# Altium project S7CAS-PLEIADES-CARTES-MERE_P07.PrjPcb (part 1 of 4)
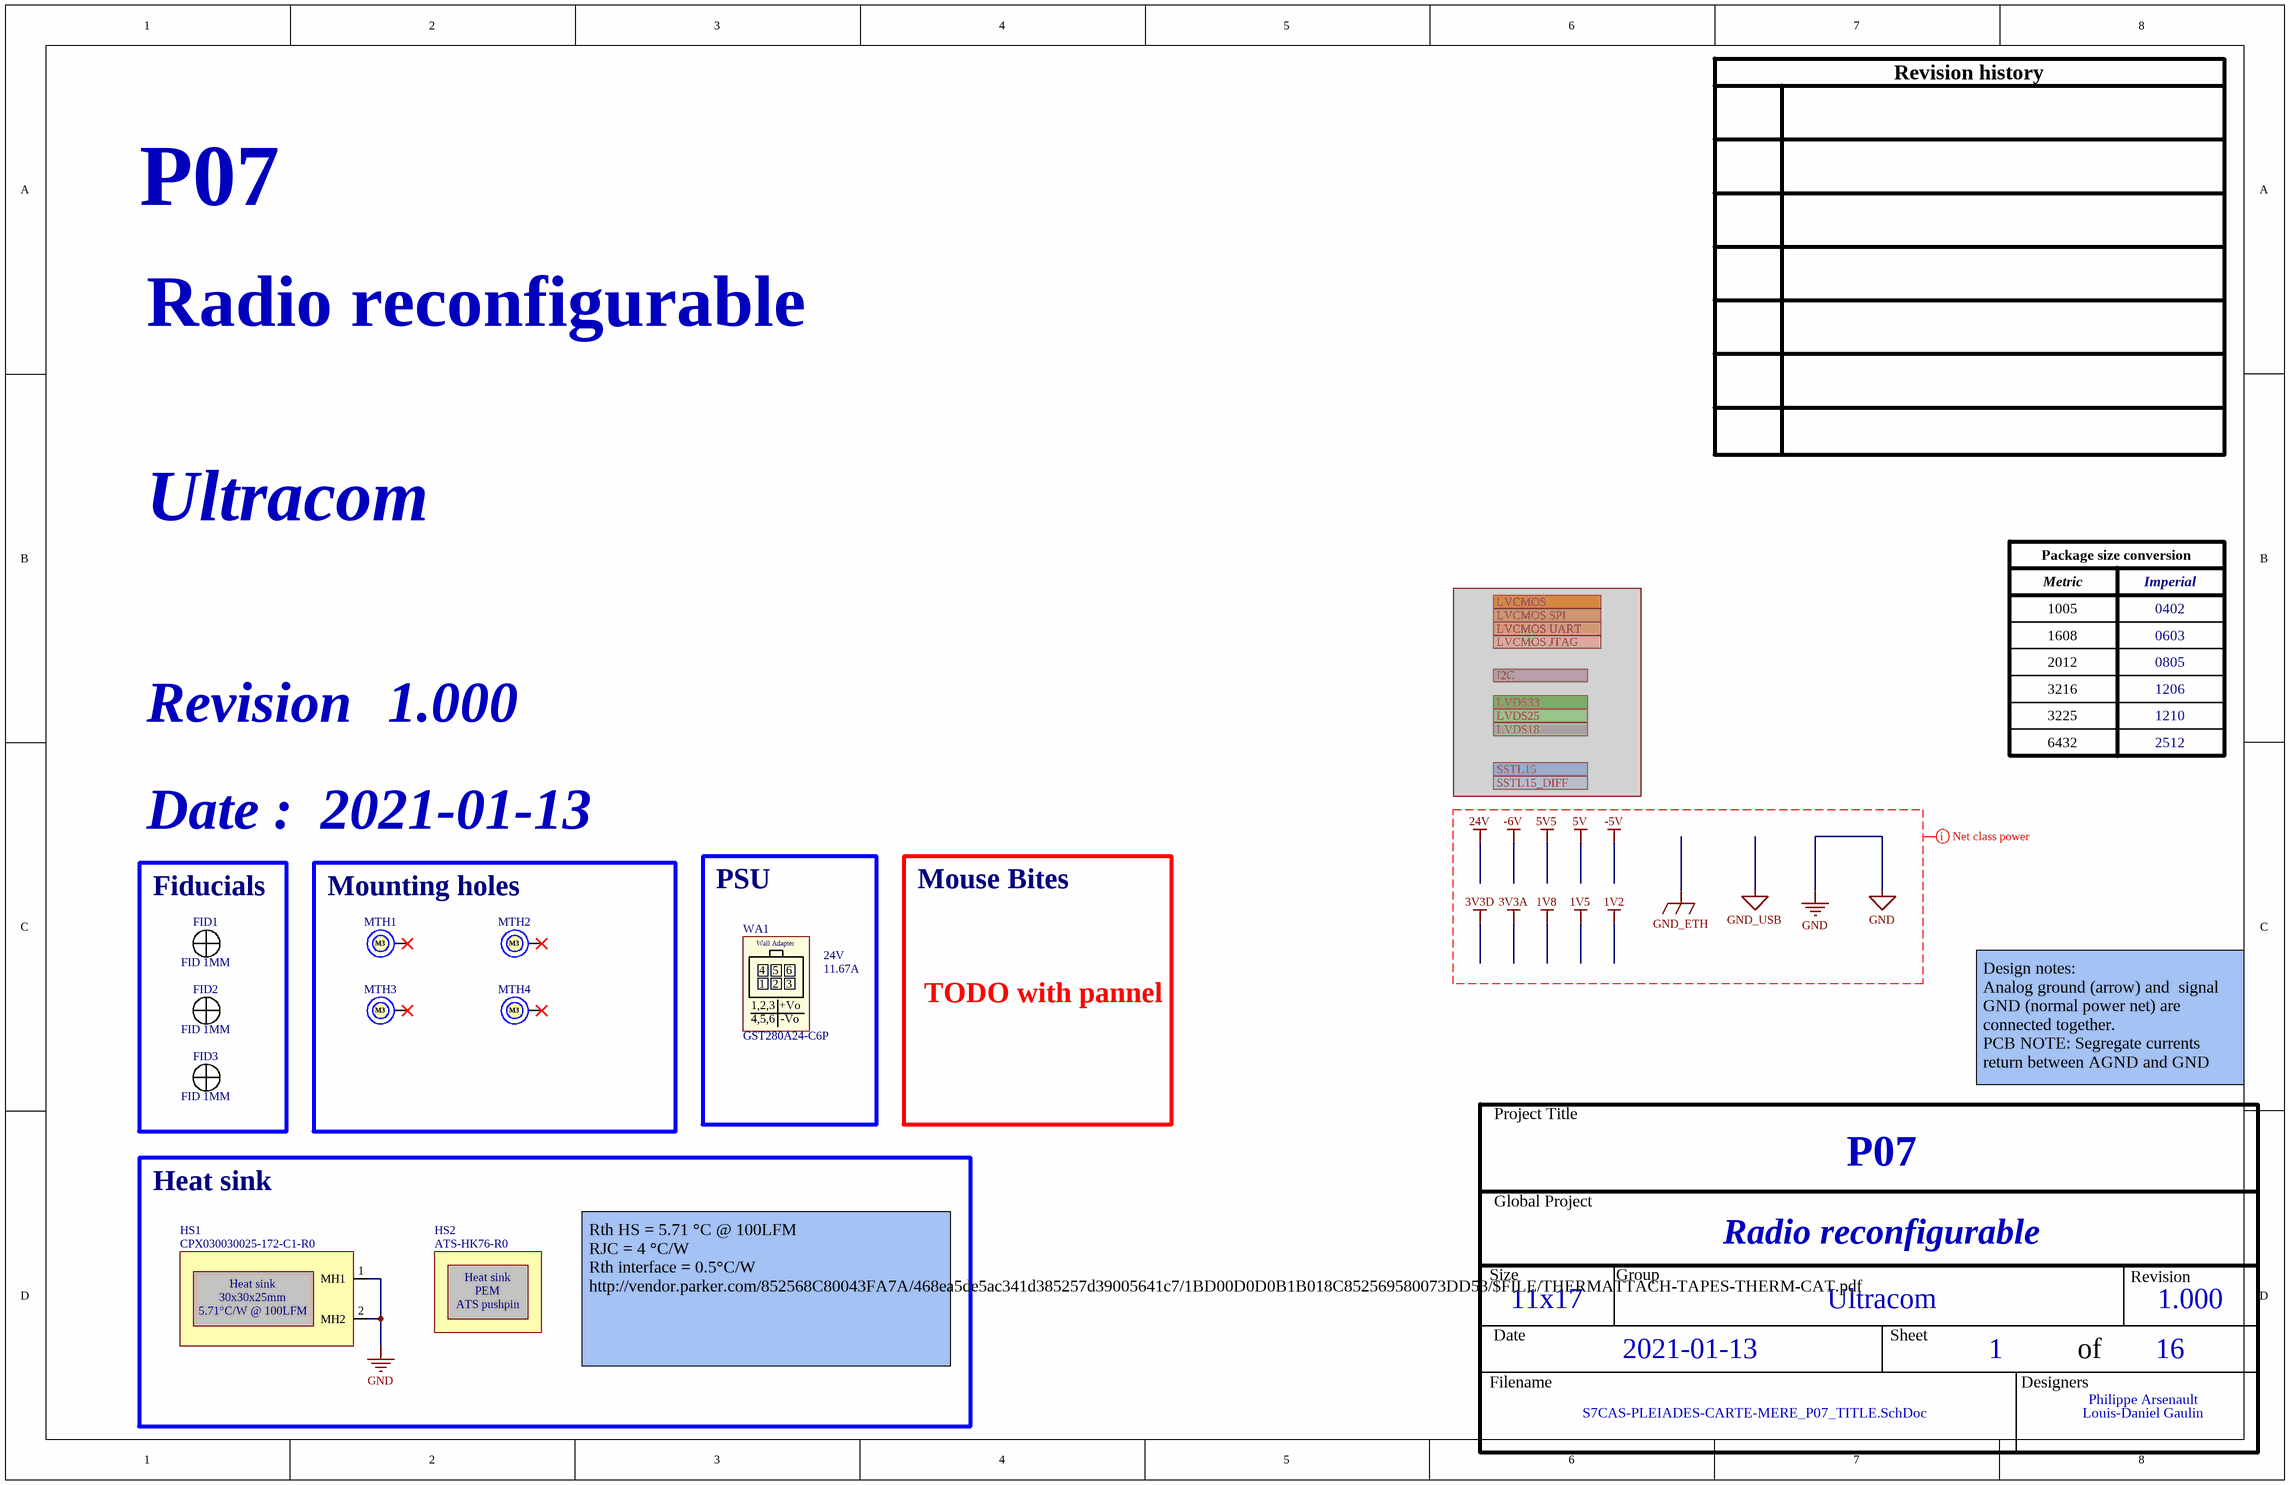
[diagram p0: S7CAS-PLEIADES-CARTE-MERE_P07_TITLE.SchDoc]
Project_Date: 2021-01-13; Project_Designer1: Philippe Arsenault; Project_Designer2: Louis-Daniel Gaulin; Project_Global: Radio reconfigurable; Project_Group: Ultracom; Project_Name: P07; Project_Revision: 1.000; Project_Stencil_Bot_Thickness: 0.1 MM; Project_Stencil_Top_Thickness: 0.1 MM
16 sheets, 549 parts. Net scope: flat (ports and power ports of the same name join across sheets).
Board files: S7CAS-PLEIADES-CARTE-MERE_P07.PcbDoc, S7CAS-PLEIADES-CARTE-MERE_P07 -PANEL.PcbDoc
Sheets:
  S7CAS-PLEIADES-CARTE-MERE_P07_TITLE.SchDoc
  S7CAS-PLEIADES-CARTE-MERE_P07_HIGH_POWER.SchDoc
  S7CAS-PLEIADES-CARTE-MERE_P07_LOW_POWER.SchDoc
  S7CAS-PLEIADES-CARTE-MERE_P07_FPGA_0.SchDoc
  S7CAS-PLEIADES-CARTE-MERE_P07_FPGA_1.SchDoc
  S7CAS-PLEIADES-CARTE-MERE_P07_FPGA_2.SchDoc
  S7CAS-PLEIADES-CARTE-MERE_P07_FPGA_3.SchDoc
  S7CAS-PLEIADES-CARTE-MERE_P07_FPGA_4-5.SchDoc
  S7CAS-PLEIADES-CARTE-MERE_P07_FPGA_MISC.SchDoc
  S7CAS-PLEIADES-CARTE-MERE_P07_CLOCK.SchDoc
  S7CAS-PLEIADES-CARTE-MERE_P07_DDR.SchDoc
  S7CAS-PLEIADES-CARTE-MERE_P07_USB.SchDoc
  S7CAS-PLEIADES-CARTE-MERE_P07_MOT.SchDoc
  S7CAS-PLEIADES-CARTE-MERE_P07_ETH.SchDoc
  S7CAS-PLEIADES-CARTE-MERE_P07_ADC.SchDoc
  S7CAS-PLEIADES-CARTE-MERE_P07_DAC.SchDoc

## Sheet S7CAS-PLEIADES-CARTE-MERE_P07_TITLE.SchDoc
size Tabloid; DocumentNumber: 1; SheetNumber: 1; SheetTotal: 16; Sheet_Name: Title; Size: 11x17

### Parts
FID1  FID 1MM  [FID_CIRCLE_1MM]
FID2  FID 1MM  [FID_CIRCLE_1MM]
FID3  FID 1MM  [FID_CIRCLE_1MM]
HS1  CPX030030025-172-C1-R0  [THE_HS_ATS-CPX030030025-172-C1-R0]
HS2  ATS-HK76-R0  [THE_HS_ATS-CPX030030025-172-C1-R0]  (mechanical)
MTH1  M3  [MTH_M3]  (no BOM)
MTH2  M3  [MTH_M3]  (no BOM)
MTH3  M3  [MTH_M3]  (no BOM)
MTH4  M3  [MTH_M3]  (no BOM)
WA1  GST280A24-C6P  value 24V  Current Rating: 11.67A  [Model Name]  (mechanical)

### Blocks framed on the sheet
Fiducials: FID1-FID3
Mounting holes: MTH1-MTH4
PSU: WA1
Heat sink: HS1 HS2

### Ports
I2C, LVCMOS, LVCMOS JTAG, LVCMOS SPI, LVCMOS UART, LVDS18, LVDS25, LVDS33, SSTL15, SSTL15_DIFF

### Nets
GND: HS1.1(MH1) HS1.2(MH2)

Not connected (* = marked no-connect by the designer): FID1 1 2; FID2 1 2; FID3 1 2; MTH1 1*; MTH2 1*; MTH3 1*; MTH4 1*

### Layout directives
net class POWER: 1V2, 1V5, 1V8, 3V3A, 3V3D, 5V, 5V5, 24V, -5V, -6V, GND, GND_ETH, GND_USB

### Notes on the sheet
- Mouse Bites
- TODO with pannel
- Design notes:
  Analog ground (arrow) and  signal GND (normal power net) are connected together.
  PCB NOTE: Segregate currents return between AGND and GND
- Rth HS = 5.71 °C @ 100LFM
  RJC = 4 °C/W
  Rth interface = 0.5°C/W
  http://vendor.parker.com/852568C80043FA7A/468ea5de5ac341d385257d39005641c7/1BD00D0D0B1B018C852569580073DD53/$FILE/THERMATTACH-TAPES-THERM-CAT.pdf
- Revision history
- Package size conversion
- Metric
- 1005
- 1608
- Imperial
- 0402
- 0603
- Revision
- 2012
- 3216
- 0805
- 1206
- 3225
- 6432
- 1210
- 2512
- Date :
- Project Title
- Global Project
- Size
- Group
- Date
- Sheet
- of
- Filename
- Designers
- (in symbol MEC_ATS-HK76-R0) Heat sink; PEM; ATS pushpin
- (in symbol THE_HS_ATS-CPX030030025-172-C1-R0) Heat sink; 30x30x25mm; 5.71°C/W @ 100LFM
- (in symbol UND_GST280A24-C6P) Wall Adapter; 4; 5; 6; 1; 2; 3; 1,2,3; +Vo; 4,5,6; -Vo

### Library data of the parts
FID1-FID3 = FID_CIRCLE_1MM: FID - FIDUCIAL 1MM CIRCLE DOUBLE-SIDED - 1MM; GRAMS Lib Spec: 2.8; Magnetic Material: NO; Cryo: UNKNOWN; Value: *; Tolerance: *; Voltage Rating: *; Current Rating: *; Power Max: *; HelpURL: https://www.pcb-3d.com/wordpress/wp-content/uploads/ipc-sm-782a_amendment_1_and_2.pdf; CreatedBy/Date: Jonathan Bouchard 2018-07-23; VerifiedBy: Caroline Paulin - 25 juillet 2018; Temperature: *; Package: 1MM CIRCLE; Manufacturer #1: *; Manufacturer #2: *; Note: *; Assembly Type: NONE; Part Number #2: *; Part Number #1: *; Polarized: *; Supplier 1: *; Supplier Part Number 1: *
HS1 = THE_HS_ATS-CPX030030025-172-C1-R0: THE_HS - Heat Sink 30x30x25 mm - TH; Power Max: 5.71 °C/W @ 100LFM; HelpURL: https://www.digikey.ca/en/products/detail/advanced-thermal-solutions-inc/ATS-CPX030030025-172-C1-R0/4753835; Part Number #1: CPX030030025-172-C1-R0; Supplier 1: Digi-Key; Supplier Part Number 1: ATS35935-ND
HS2 = MEC_ATS-HK76-R0: MEC - Heat Sink PEM - TH; Power Max: 5.71 °C/W @ 100LFM; HelpURL: https://www.digikey.ca/en/products/detail/advanced-thermal-solutions-inc/ATS-HK76-R0/4809541; Part Number #1: ATS-HK76-R0; Supplier 1: Digi-Key; Supplier Part Number 1: ATS1911-ND
MTH1-MTH4 = MTH_M3: MTH - MOUNTING HOLE M3 PLATED - M3; GRAMS Lib Spec: 2.8; Magnetic Material: NO; Cryo: UNKNOWN; Value: *; Tolerance: *; Voltage Rating: *; Current Rating: *; Power Max: *; HelpURL: https://littlemachineshop.com/images/gallery/PDF/TapDrillSizes.pdf; CreatedBy/Date: Jonathan Bouchard 2018-07-23; VerifiedBy: Arnaud Samson 23-07-18; Temperature: *; Package: M3; Manufacturer #1: *; Manufacturer #2: *; Note: *; Assembly Type: NONE; Part Number #2: *; Part Number #1: *; Polarized: *; Supplier 1: *; Supplier Part Number 1: *
WA1 = UND_GST280A24-C6P: UND - AC/DC DESKTOP ADAPTER 24V 280W - MEC; Manufacturer #1: MEAN WELL USA Inc.; Tolerance: ±3%; Voltage Rating: 85~264VAC; GRAMS Lib Spec: 2.8; Magnetic Material: Unknown; Polarized: Yes; Power Max: 280W; HelpURL: https://www.meanwell.com/Upload/PDF/GST280A/GST280A-SPEC.PDF; CreatedBy/Date: Caroline Paulin - 5 avril 2019; VerifiedBy: Nicolas V. (2019-07-05); Temperature: -30°C to +70°C; Package: -; Manufacturer #2: *; Note: *; Assembly Type: -; Part Number #2: *; Part Number #1: GST280A24-C6P; Supplier 1: Digi-Key; Supplier Part Number 1: 1866-2122-ND; Cryo: UNKNOWN

## Sheet S7CAS-PLEIADES-CARTE-MERE_P07_HIGH_POWER.SchDoc
size Tabloid; DocumentNumber: 2; SheetNumber: 2; SheetTotal: 16; Sheet_Name: HIGH POWER VALUES; Size: 11x17
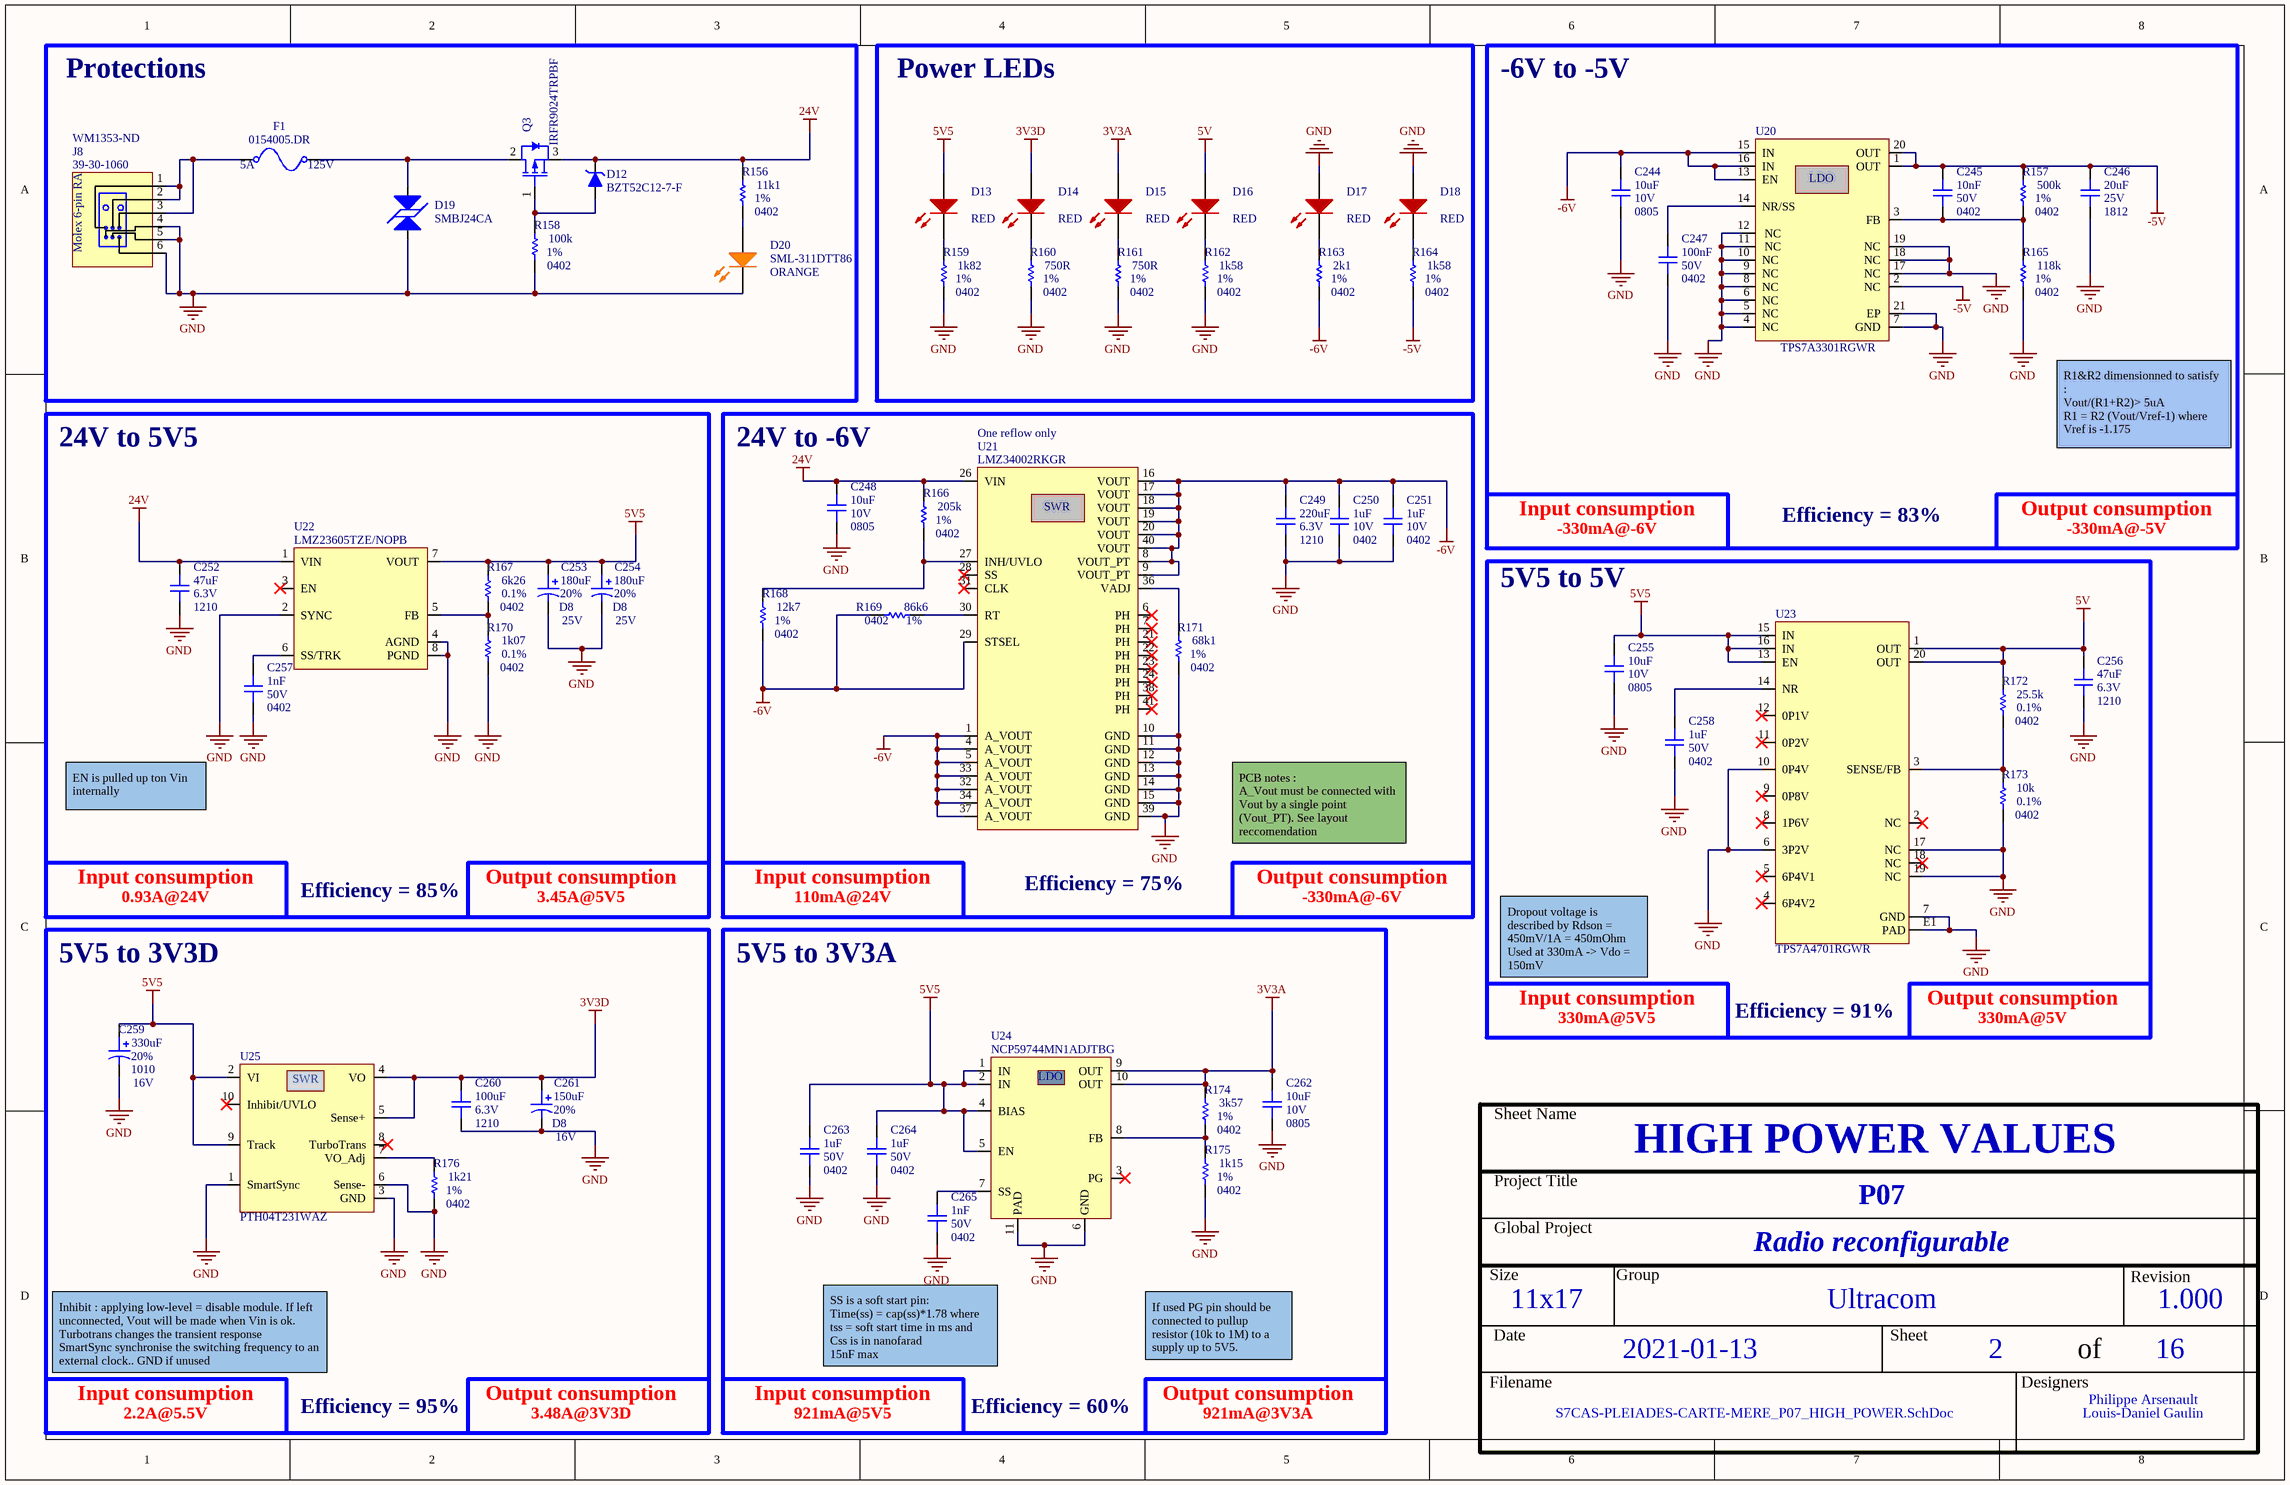
[diagram p1: S7CAS-PLEIADES-CARTE-MERE_P07_HIGH_POWER.SchDoc]

### Parts
C244  value 10uF  Voltage: 10V  Package: 0805  [CAP_0805]  (hidden comment: CAP - 0805)
C245  value 10nF  Voltage: 50V  Package: 0402  [CAP_0402]  (hidden comment: CAP - 0402)
C246  value 20uF  Voltage: 25V  Package: 1812  [CAP_1812]  (hidden comment: CAP - 1812)
C247  value 100nF  Voltage: 50V  Package: 0402  [CAP_0402]  (hidden comment: CAP - 0402)
C248  value 10uF  Voltage: 10V  Package: 0805  [CAP_0805]  (hidden comment: CAP - 0805)
C249  value 220uF  Voltage: 6.3V  Package: 1210  [CAP_1210]  (hidden comment: CAP - 1210)
C250  value 1uF  Voltage: 10V  Package: 0402  [CAP_0402]  (hidden comment: CAP - 0402)
C251  value 1uF  Voltage: 10V  Package: 0402  [CAP_0402]  (hidden comment: CAP - 0402)
C252  value 47uF  Voltage: 6.3V  Package: 1210  [CAP_1210]  (hidden comment: CAP - 1210)
C253  value 180uF  Voltage: 25V  Package: D8  Precision: 20%  [CAP_ALU_D8]  (hidden comment: EEE-FNE181XUP)
C254  value 180uF  Voltage: 25V  Package: D8  Precision: 20%  [CAP_ALU_D8]  (hidden comment: EEE-FNE181XUP)
C255  value 10uF  Voltage: 10V  Package: 0805  [CAP_0805]  (hidden comment: CAP - 0805)
C256  value 47uF  Voltage: 6.3V  Package: 1210  [CAP_1210]  (hidden comment: CAP - 1210)
C257  value 1nF  Voltage: 50V  Package: 0402  [CAP_0402]  (hidden comment: CAP - 0402)
C258  value 1uF  Voltage: 50V  Package: 0402  [CAP_0402]  (hidden comment: CAP - 0402)
C259  value 330uF  Voltage: 16V  Package: 1010  Precision: 20%  [CAP_ALU_1010_vishay]  (hidden comment: MAL214699501E3)
C260  value 100uF  Voltage: 6.3V  Package: 1210  [CAP_1210]  (hidden comment: CAP - 1210)
C261  value 150uF  Voltage: 16V  Package: D8  Precision: 20%  [CAP_ALU_D8]  (hidden comment: EEE-FKC151XAP)
C262  value 10uF  Voltage: 10V  Package: 0805  [CAP_0805]  (hidden comment: CAP - 0805)
C263  value 1uF  Voltage: 50V  Package: 0402  [CAP_0402]  (hidden comment: CAP - 0402)
C264  value 1uF  Voltage: 50V  Package: 0402  [CAP_0402]  (hidden comment: CAP - 0402)
C265  value 1nF  Voltage: 50V  Package: 0402  [CAP_0402]  (hidden comment: CAP - 0402)
D12  BZT52C12-7-F  [SOD123_DIO]
D13  value RED  [LED_0603]  (hidden comment: SML-311UTT86)
D14  value RED  [LED_0603]  (hidden comment: SML-311UTT86)
D15  value RED  [LED_0603]  (hidden comment: SML-311UTT86)
D16  value RED  [LED_0603]  (hidden comment: SML-311UTT86)
D17  value RED  [LED_0603]  (hidden comment: SML-311UTT86)
D18  value RED  [LED_0603]  (hidden comment: SML-311UTT86)
D19  SMBJ24CA  [TVS_PWR_SMBJ36CA]
D20  SML-311DTT86  value ORANGE  [LED_0603]
F1  0154005.DR  Voltage Rating: 125V  Current Rating: 5A  [FUS_0154XXX.DR]
J8  39-30-1060  Supplier Part Number 1: WM1353-ND  [CONN_MOL_39-30-1060]
Q3  IRFR9024TRPBF  [TRX_PMOS_IRFR9024TRPBF]
R156  value 11k1  Package: 0402  Precision: 1%  [RES_0402]  (hidden comment: RES - 0402)
R157  value 500k  Package: 0402  Precision: 1%  [RES_0402]  (hidden comment: RES - 0402)
R158  value 100k  Package: 0402  Precision: 1%  [RES_0402]  (hidden comment: RES - 0402)
R159  value 1k82  Package: 0402  Precision: 1%  [RES_0402]  (hidden comment: RES - 0402)
R160  value 750R  Package: 0402  Precision: 1%  [RES_0402]  (hidden comment: RES - 0402)
R161  value 750R  Package: 0402  Precision: 1%  [RES_0402]  (hidden comment: RES - 0402)
R162  value 1k58  Package: 0402  Precision: 1%  [RES_0402]  (hidden comment: RES - 0402)
R163  value 2k1  Package: 0402  Precision: 1%  [RES_0402]  (hidden comment: RES - 0402)
R164  value 1k58  Package: 0402  Precision: 1%  [RES_0402]  (hidden comment: RES - 0402)
R165  value 118k  Package: 0402  Precision: 1%  [RES_0402]  (hidden comment: RES - 0402)
R166  value 205k  Package: 0402  Precision: 1%  [RES_0402]  (hidden comment: RES - 0402)
R167  value 6k26  Package: 0402  Precision: 0.1%  [RES_0402]  (hidden comment: RES - 0402)
R168  value 12k7  Package: 0402  Precision: 1%  [RES_0402]  (hidden comment: RES - 0402)
R169  value 86k6  Package: 0402  Precision: 1%  [RES_0402]  (hidden comment: RES - 0402)
R170  value 1k07  Package: 0402  Precision: 0.1%  [RES_0402]  (hidden comment: RES - 0402)
R171  value 68k1  Package: 0402  Precision: 1%  [RES_0402]  (hidden comment: RES - 0402)
R172  value 25.5k  Package: 0402  Precision: 0.1%  [RES_0402]  (hidden comment: RES - 0402)
R173  value 10k  Package: 0402  Precision: 0.1%  [RES_0402]  (hidden comment: RES - 0402)
R174  value 3k57  Package: 0402  Precision: 1%  [RES_0402]  (hidden comment: RES - 0402)
R175  value 1k15  Package: 0402  Precision: 1%  [RES_0402]  (hidden comment: RES - 0402)
R176  value 1k21  Package: 0402  Precision: 1%  [RES_0402]  (hidden comment: RES - 0402)
U20  TPS7A3301RGWR  [REG_LDO_TPS7A3301RGWR]
U21  LMZ34002RKGR  Assembly Note: One reflow only  [REG_SWR_LMZ34002RKGR]
U22  LMZ23605TZE/NOPB  [REG_SWR_LMZ23605TZE/NOPB]
U23  TPS7A4701RGWR  [REG_TPS7A4701RGWR]
U24  NCP59744MN1ADJTBG  [REG_LDO_NCP59744MN1ADJTBG]
U25  PTH04T231WAZ  [REG_SWR_PTH04T231WAZ]

### Blocks framed on the sheet
Protections: D12 D19 D20 F1 J8 Q3 R156 R158
Power LEDs: D13-D18 R159-R164
-6V to -5V: C244-C247 R157 R165 U20
24V to 5V5: C252-C254 C257 R167 R170 U22
24V to -6V: C248-C251 R166 R168 R169 R171 U21
5V5 to 5V: C255 C256 C258 R172 R173 U23
5V5 to 3V3D: C259-C261 R176 U25
5V5 to 3V3A: C262-C265 R174 R175 U24

### Nets
3V3A: C262.2 D15.A R174.2 U24.9(OUT) U24.10(OUT)
3V3D: C260.2 C261.1 D14.A U25.4(VO) U25.5(Sense+)
5V: C256.2 D16.A R172.2 U23.1(OUT) U23.20(OUT)
5V5: C253.1 C254.1 C255.2 C259.1 C263.2 C264.2 D13.A R167.2 U22.7(VOUT) U23.13(EN) U23.15(IN) U23.16(IN) U24.1(IN) U24.2(IN) U24.4(BIAS) U24.5(EN) U25.2(VI) U25.9(Track)
24V: C248.2 C252.2 D12.1 Q3.3(D) R156.2 R166.2 U21.26(VIN) U22.1(VIN)
-5V: C245.2 C246.2 R157.2 R164.1 U20.1(OUT) U20.2(NC) U20.20(OUT)
-6V: C244.2 C249.2 C250.2 C251.2 R163.1 R168.1 R169.1 U20.13(EN) U20.15(IN) U20.16(IN) U21.1(A_VOUT) U21.4(A_VOUT) U21.5(A_VOUT) U21.8(VOUT_PT) U21.9(VOUT_PT) U21.16(VOUT) U21.17(VOUT) U21.18(VOUT) U21.19(VOUT) U21.20(VOUT) U21.29(STSEL) U21.32(A_VOUT) U21.33(A_VOUT) U21.34(A_VOUT) U21.37(A_VOUT) U21.40(VOUT)
GND: C244.1 C246.1 C247.1 C248.1 C249.1 C250.1 C251.1 C252.1 C253.2 C254.2 C255.1 C256.1 C257.1 C258.1 C259.2 C260.1 C261.2 C262.1 C263.1 C264.1 C265.1 D17.A D18.A D19.2 D20.K J8.4 J8.5 J8.6 R158.1 R159.1 R160.1 R161.1 R162.1 R165.1 R170.1 R171.1 R173.1 R175.1 R176.1 U20.4(NC) U20.5(NC) U20.6(NC) U20.7(GND) U20.8(NC) U20.9(NC) U20.10(NC) U20.11(NC) U20.12(NC) U20.17(NC) U20.18(NC) U20.19(NC) U20.21(EP) U21.10(GND) U21.11(GND) U21.12(GND) U21.13(GND) U21.14(GND) U21.15(GND) U21.39(GND) U22.2(SYNC) U22.4(AGND) U22.8(PGND) U23.6(3P2V) U23.7(GND) U23.10(0P4V) U23.17(NC) U23.19(NC) U23.E1(PAD) U24.6(GND) U24.11(PAD) U25.1(SmartSync) U25.3(GND) U25.6(Sense-)
NetC245_1: C245.1 R157.1 R165.2 U20.3(FB)
NetC247_2: C247.2 U20.14(NR/SS)
NetC257_2: C257.2 U22.6(SS/TRK)
NetC258_2: C258.2 U23.14(NR)
NetC265_2: C265.2 U24.7(SS)
NetD12_2: D12.2 Q3.1(G) R158.2
NetD13_K: D13.K R159.2
NetD14_K: D14.K R160.2
NetD15_K: D15.K R161.2
NetD16_K: D16.K R162.2
NetD17_K: D17.K R163.2
NetD18_K: D18.K R164.2
NetD19_1: D19.1 F1.2 Q3.2(S)
NetD20_A: D20.A R156.1
NetF1_1: F1.1 J8.1 J8.2 J8.3
NetR166_1: R166.1 R168.2 U21.27(INH/UVLO)
NetR167_1: R167.1 R170.2 U22.5(FB)
NetR169_2: R169.2 U21.30(RT)
NetR171_2: R171.2 U21.36(VADJ)
NetR172_1: R172.1 R173.2 U23.3(SENSE/FB)
NetR174_1: R174.1 R175.2 U24.8(FB)
NetR176_2: R176.2 U25.7(VO_Adj)

Not connected (* = marked no-connect by the designer): U21 2(DNC) 3(DNC) 6(PH)* 7(PH)* 21(PH)* 22(PH)* 23(PH)* 24(PH)* 25(DNC) 28(SS)* 31(CLK)* 35(DNC) 38(PH)* 41(PH)*; U22 3(EN)*; U23 2(NC)* 4(6P4V2)* 5(6P4V1)* 8(1P6V)* 9(0P8V)* 11(0P2V)* 12(0P1V)* 18(NC)*; U24 3(PG)*; U25 8(TurboTrans)* 10(Inhibit/UVLO)*

### Notes on the sheet
- R1&R2 dimensionned to satisfy :
  Vout/(R1+R2)> 5uA
  R1 = R2 (Vout/Vref-1) where Vref is -1.175
- -330mA@-6V
- Input consumption
- Efficiency = 83%
- -330mA@-5V
- Output consumption
- EN is pulled up ton Vin internally
- PCB notes :
  A_Vout must be connected with Vout by a single point (Vout_PT). See layout reccomendation
- 0.93A@24V
- Efficiency = 85%
- 3.45A@5V5
- 110mA@24V
- Efficiency = 75%
- Dropout voltage is described by Rdson = 450mV/1A = 450mOhm
  Used at 330mA -> Vdo = 150mV
- 330mA@5V5
- Efficiency = 91%
- 330mA@5V
- Inhibit : applying low-level = disable module. If left unconnected, Vout will be made when Vin is ok.
  Turbotrans changes the transient response
  SmartSync synchronise the switching frequency to an external clock.. GND if unused
- SS is a soft start pin:
  Time(ss) = cap(ss)*1.78 where tss = soft start time in ms and Css is in nanofarad
  15nF max
- If used PG pin should be connected to pullup resistor (10k to 1M) to a supply up to 5V5.
- 2.2A@5.5V
- Efficiency = 95%
- 3.48A@3V3D
- 921mA@5V5
- Efficiency = 60%
- 921mA@3V3A
- Sheet Name
- Project Title
- Global Project
- Size
- Group
- Revision
- Date
- Sheet
- of
- Filename
- Designers
- (in symbol CONN_MOL_39-30-1060) Molex 6-pin RA
- (in symbol REG_LDO_NCP59744MN1ADJTBG) LDO
- (in symbol REG_LDO_TPS7A3301RGWR) LDO
- (in symbol REG_SWR_LMZ34002RKGR) SWR
- (in symbol REG_SWR_PTH04T231WAZ) SWR

### Library data of the parts
C244 C248 C255 C262 = CAP - 0805: Mfg: CL21B106KPQNNNE; Precision: 10%; Current: *; CreatedBy: Jonathan Bouchard; Power: *
C245 C247 C250 C251 = CAP - 0402: Precision: 10%; Current: *; CreatedBy: Jonathan Bouchard; Power: *
C246 = CAP - 1812: Precision: 10%; Current: *; CreatedBy: Jonathan Bouchard; Power: *
C249 = CAP - 1210: Mfg Part Number: GRM32ER60J227ME05L; Precision: 10%; Current: *; CreatedBy: Jonathan Bouchard; Power: *
C252 C256 C260 = CAP - 1210: Precision: 10%; Current: *; CreatedBy: Jonathan Bouchard; Power: *
C253 C254 = CAP_ALU_EEE-FNE181XUP: CAP ALUM 180UF 25VDC 20% SMD; Current: 1.3A; CreatedBy: Philippe; Temperature: -55°C ~ 105°C; Power: *; Supplier 1: Allied Electronics; Supplier Part Number 1: 71942218
C257 C258 C263-C265 = CAP - 0402: Mfg: C1005X7R1H102K050BA; Precision: 10%; Current: *; CreatedBy: Jonathan Bouchard; Power: *
C259 = CAP_ALU_MAL214699501E3: CAP - ALU 330uF 20% 16V - 1010; Current: 750mA; Mfg: Vishay Dale; Mfg Part Number: MAL214699501E3; HelpURL: http://www.vishay.com/docs/28403/146cti.pdf; CreatedBy: Jonathan Bouchard; Temperature: -55°C to 125°C; Power: *; Supplier 1: Digikey; Supplier Part Number 1: 4405PHCT-ND
C261 = CAP_ALU_EEH-ZS1H151P: CAP ALUM 150UF 20% 16V SMD; Current: 1.3A; CreatedBy: Philippe; Temperature: -55°C ~ 105°C; Power: *; Supplier 1: Digi-Key; Supplier Part Number 1: PCE4401CT-ND
D12 = DIO_ZEN_BZT52C12-7-F: Zener Diode 12V 500mW ±5% Surface Mount SOD-123; Vendor: Diodes Inc; Built_By: EMA_UL_Team; SourceLibrary: DiodesInc_2015-05-08; Type: DEV; Manufacturer_Part_Number: BZT52C12-7-F; Copyright: Copyright (C) 2018 Accelerated Designs. All rights reserved; RefDes: RefDes
D13-D18 = LED_SML-311UTT86: LED - 620nM RED 2mA - 0603; Voltage: 1.8V; Mfg: ROHM Semiconductor; Power: 44mW; Current: 2mA; HelpURL: http://media.digikey.com/pdf/Data%20Sheets/Rohm%20PDFs/SML-311%20Series.pdf; CreatedBy: Jonathan Bouchard; Temperature: -30°C to 85°C; Package: 0603; Precision: *; Mfg Part Number: SML-311UTT86; Supplier 1: Digikey; Supplier Part Number 1: 511-1304-1-ND
D19 = TVS_PWR_SMBJ24CA: TVS - 24V 26.7V 600W - DO214AA; Manufacturer #1: Littelfuse Inc.; Value: Vbr = 26.7V -  Clamp = 38.9V; Voltage Rating: 24V Standoff; Current Rating: 15.5A; GRAMS Lib Spec: 2.8; Magnetic Material: UNKNOWN; Polarized: NO; Tolerance: *; Power Max: 600W; HelpURL: http://www.littelfuse.com/~/media/electronics/datasheets/tvs_diodes/littelfuse_tvs_diode_smbj_datasheet.pdf.pdf; CreatedBy/Date: Arnaud Samson - 06/07/18; VerifiedBy: Jonathan Bouchard - 2018-07-13; Temperature: -65°C ~ 150°C (TJ); Package: DO214AA; Manufacturer #2: *; Note: *; Assembly Type: SMD; Part Number #2: *; Part Number #1: SMBJ24CA; Supplier 1: Digi-Key; Supplier Part Number 1: SMBJ24CALFCT-ND; Cryo: UNKNOWN
D20 = LED_SML-311DTT86: LED - 611nM ORANGE 2mA - 0603; Voltage: 1.8V; Mfg: ROHM Semiconductor; Power: 44mW; Current: 2mA; HelpURL: http://media.digikey.com/pdf/Data%20Sheets/Rohm%20PDFs/SML-311%20Series.pdf; CreatedBy: Jonathan Bouchard; Temperature: -40°C to 85°C; Package: 0603; Precision: *; Mfg Part Number: SML-311DTT86; Supplier 1: Digikey; Supplier Part Number 1: 511-1303-1-ND
F1 = FUS_0154005.DR: FUS - 5 A 125 VAC/VDC - 2-SMD; Manufacturer #1: Littelfuse Inc.; Value: 5A 125V AC/DC FAST; GRAMS Lib Spec: 2.8; Magnetic Material: UNKNOWN; Polarized: NO; Tolerance: *; Power Max: *; HelpURL: http://www.littelfuse.com/~/media/electronics/datasheets/fuses/littelfuse_fuse_154_154t_154l_154tl_datasheet.pdf.pdf; CreatedBy/Date: Arnaud Samson - 06/07/18; VerifiedBy: Jonathan Bouchard 2018-07-16; Temperature: -55°C ~ 125°C; Package: 2-SMD; Manufacturer #2: *; Note: *; Assembly Type: SMD; Part Number #2: *; Part Number #1: 0154005.DR; Supplier 1: Digi-Key; Supplier Part Number 1: F1228CT-ND; Cryo: UNKNOWN
J8 = CONN_MOL_39-30-1060: CONN - MOLEX 6 PIN RA; Voltage: *; Current: *; Power: *; Mfg: Molex; Mfg Part Number: 39-30-1060; HelpURL: https://www.molex.com/pdm_docs/sd/039301060_sd.pdf; CreatedBy: Philippe Arsenault / 2021-01-31; Temperature: -30°C ~ 105°C; Value: *; Precision: *; Package: TH-6; Supplier 1: Digi-Key
Q3 = TRX_PMOS_IRFR9024TRPBF: TRX - MOSFET P-CH 60V 8.8A - Surface Mount D-Pak; Manufacturer #1: Vishay Siliconix; Power Max: 2.5W (Ta), 42W (Tc); Voltage rating: 60V (Vds max), 4V (Vgs @ 250uA); Polarized: Yes; Magnetic Material: UNKNOWN; GRAMS Lib Spec: 2.8c; Current Rating: 8.8A; Manufacturer #2: *; Value: *; Part Number #1: IRFR9024TRPBF; Part Number #2: *; HelpURL: https://www.vishay.com/docs/91278/sihfr902.pdf; Assembly Type: SMD; Temperature: -55°C ~ 150°C (TJ); Package: D-Pak; CreatedBy/Date: Philippe Arsenault / 2021-01-31; Tolerance: *; Cryo: UNKNOWN; Supplier 1: Digi-Key; Supplier Part Number 1: IRFR9024PBFCT-ND
R156-R176 = RES - 0402: Voltage: 50V; Power: 1/16W; Current: *; CreatedBy: Jonathan Bouchard
U20 = REG_LDO_TPS7A3301RGWR: REG - LDO Negative Adjustable 1 Output -1.18V-33V 1A -  20-VQFN (5x5); Manufacturer #1: Texas Instruments; Value: -1.18V~-33V; Voltage Rating: -36V; GRAMS Lib Spec: 2.8; Magnetic Material: Unknown; Polarized: Yes; Tolerance: *; Current Rating: 1A; Power Max: *; HelpURL: http://www.ti.com/lit/ds/symlink/tps7a33.pdf; CreatedBy/Date: Keven Deslandes - 2018/10/11; VerifiedBy: Caroline Paulin - 11/12/2018; Temperature: -40°C ~ 125°C; Package: 20-VQFN; Manufacturer #2: *; Assembly Type: SMD; Part Number #2: *; Part Number #1: TPS7A3301RGWR; Supplier 1: Digi-Key; Supplier Part Number 1: 296-39502-1-ND; Cryo: UNKNOWN
U21 = REG_SWR_LMZ34002RKGR: REG - DC DC Converter -3V to -17V 2A - 41-B1QFN; Manufacturer #1: Texas Instruments; Value: -3 ~ -17V; Voltage Rating: 4.5-40V; Power Max: 15W; GRAMS Lib Spec: 2.8c; Magnetic Material: Unknown; Polarized: Yes; Tolerance: *; Current Rating: 2A; HelpURL: http://www.ti.com/lit/ds/symlink/lmz34002.pdf; CreatedBy/Date: P.Marcoux  20-06-2019; VerifiedBy: C.Paulin - 22/01/2020; Temperature: -40°C ~ 85°C; Package: 41-B1QFN; Manufacturer #2: *; Note: *; Assembly Type: SMD; Part Number #2: *; Part Number #1: LMZ34002RKGR; Supplier 1: Digi-Key; Supplier Part Number 1: 296-44356-1-ND; Cryo: UNKNOWN
U22 = REG_SWR_LMZ23605TZE/NOPB: REG - IC BUCK SYNC 36V 5A - TO-PMOD-7; Manufacturer #1: Texas Instruments; Value: 0.8 ~ 6 V; Voltage Rating: 6 ~ 36 V; GRAMS Lib Spec: 2.8; Note: One Reflow; Magnetic Material: YES; Cryo: UNKNOWN; Tolerance: *; Current Rating: 5A; Power Max: *; HelpURL: http://www.ti.com/lit/ds/symlink/lmz23605.pdf; CreatedBy/Date: Arnaud Samson - 05/07/18; VerifiedBy: Jonathan Bouchard 2018-07-13; Temperature: -40°C ~ 125°C; Package: TO-PMOD-7; Manufacturer #2: *; Assembly Type: SMD; Part Number #2: *; Part Number #1: LMZ23605TZE/NOPB; Polarized: YES; Supplier 1: Digi-Key; Supplier Part Number 1: 296-35357-1-ND
U23 = REG_LDO_TPS7A4701RGWR: REG - LINEAR POS ADJ 1A - 20VQFN; Manufacturer #1: Texas Instruments; GRAMS Lib Spec: 2.8; Magnetic Material: Unknown; Polarized: Yes; Value: 1.4 à 34V; Voltage rating: 35V max; Assembly Type: SMD; CreatedBy/Date: L-P Gauthier / 2018-05-29; Current Rating: 1A; Manufacturer #2: TBD; Part Number #1: TPS7A4701RGWR; Part Number #2: TBD; Package: 20-VQFN Exposed Pad; Power Max: *; Tolerance: -; Supplier 1: Digi-Key; Supplier Part Number 1: 296-37224-1-ND; VerifiedBy: Caroline Paulin - 28 sept 2018; Temperature: -40°C ~ 125°C; HelpURL: http://www.ti.com/lit/ds/symlink/tps7a47.pdf; Cryo: UNKNOWN
U24 = REG_LDO_NCP59744MN1ADJTBG: REG - LINEAR POS ADJ 3A BIAS - 10-VFDFN; Manufacturer #1: ON Semiconductor; Value: 0.8V ~ 3.6V; Voltage Rating: (Vout+VDO) ~ 5.5V; Power Max: 10.8W; GRAMS Lib Spec: 2.8; Magnetic Material: Unknown; Polarized: Yes; Tolerance: -; Current Rating: 3A; HelpURL: https://www.onsemi.com/pub/Collateral/NCP59744-D.PDF; CreatedBy/Date: Raphael Bouchard / 2019-06-07; VerifiedBy: C.Paulin - 13/06/2019; Temperature: -40°C ~ 125°C (TJ); Package: 10-VFDFN; Manufacturer #2: -; Note: -; Assembly Type: SMD; Part Number #2: -; Part Number #1: NCP59744MN1ADJTBG; Supplier 1: Digi-Key; Supplier Part Number 1: NCP59744MN1ADJTBGOSCT-ND; Cryo: UNKNOWN
U25 = REG_SWR_PTH04T231WAZ: REG - MODULE PIP 6A 2.2V/5.5V - 10SMD; Manufacturer #1: Texas Instruments; Current Rating: 6A (out); Value: 0.69 - 3.6V (Out); Voltage rating: 2.2-5.5V (Input); Polarized: Yes; Magnetic Material: UNKNOWN; Manufacturer #2: *; Note: *; Power Max: *; Part Number #1: PTH04T231WAZ; Part Number #2: *; HelpURL: http://www.ti.com/lit/ds/symlink/pth04t231w.pdf; Supplier 1: Digi-Key; Assembly Type: SMD; Temperature: -40°C ~ 85°C; Supplier Part Number 1: 296-21792-ND; Package: SMD; CreatedBy/Date: Olivier Bernard / 6/5/2018; VerifiedBy: Caroline Paulin / 10 juillet 2018; Cryo: UNKNOWN

## Sheet S7CAS-PLEIADES-CARTE-MERE_P07_LOW_POWER.SchDoc
size Tabloid; DocumentNumber: 3; SheetNumber: 3; SheetTotal: 16; Sheet_Name: LOW VALUE POWER; Size: 11x17
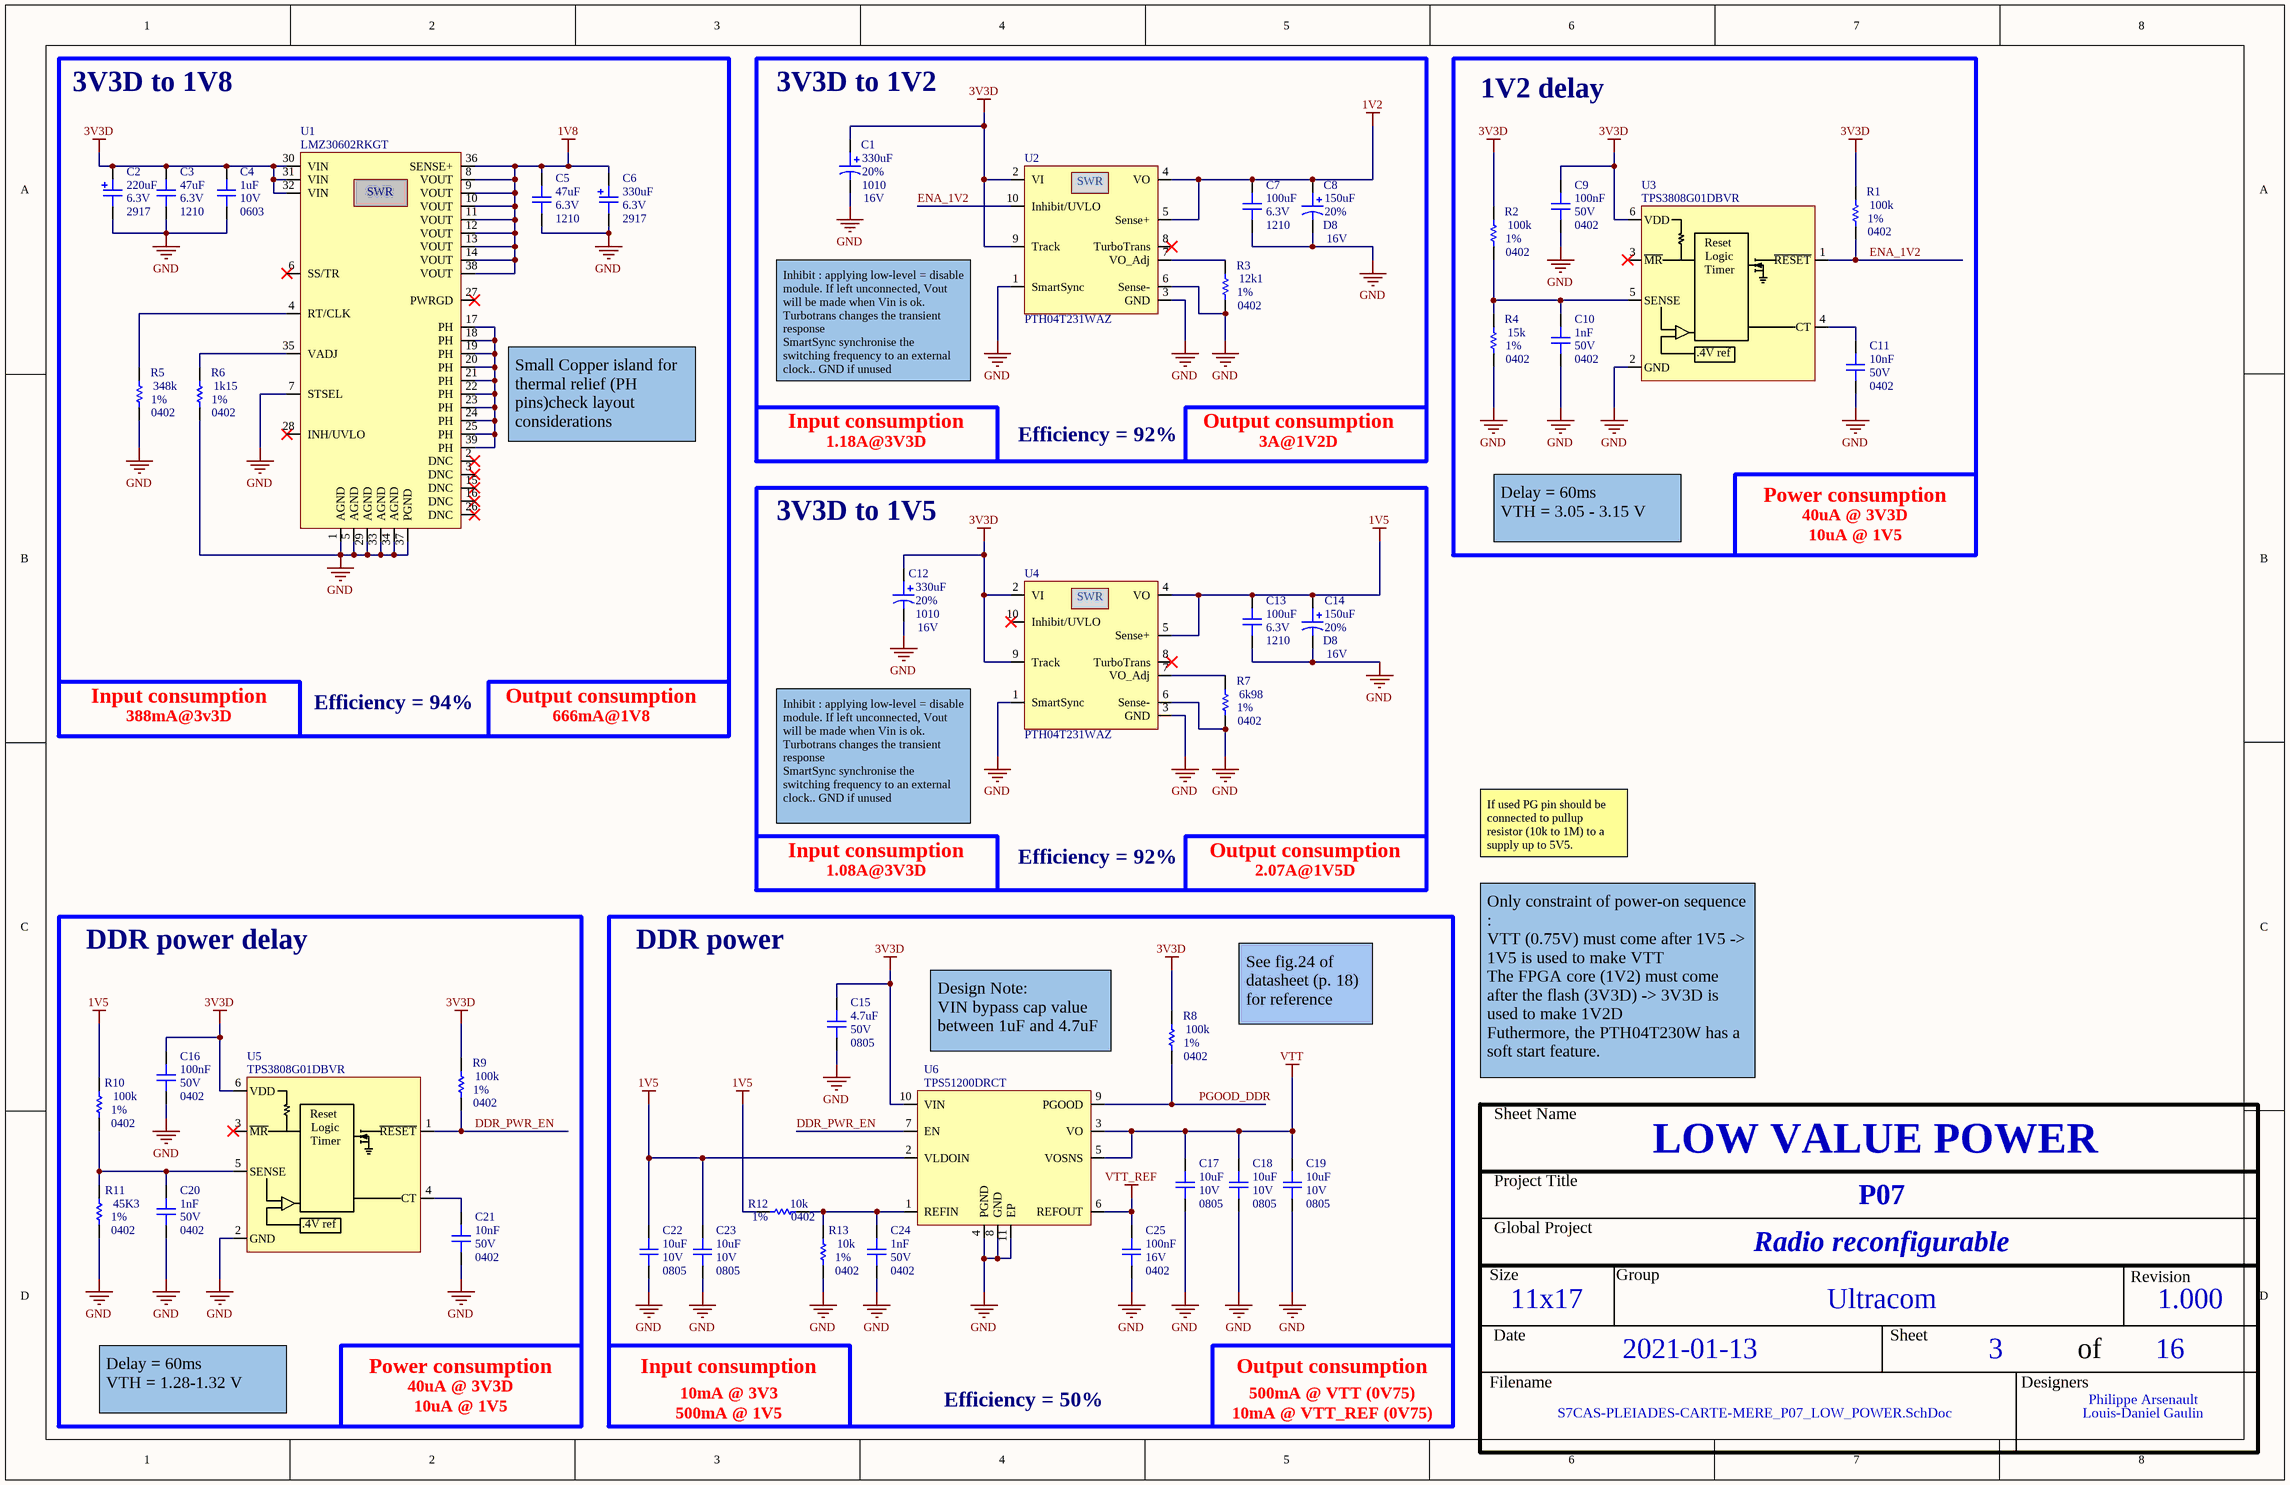
[diagram p2: S7CAS-PLEIADES-CARTE-MERE_P07_LOW_POWER.SchDoc]

### Parts
C1  value 330uF  Voltage: 16V  Package: 1010  Precision: 20%  [CAP_ALU_1010_vishay]  (hidden comment: MAL214699501E3)
C2  value 220uF  Voltage: 6.3V  Package: 2917  [CAP_TAN_2917(D)]  (hidden comment: CAP - TANTALUM - CASE D)
C3  value 47uF  Voltage: 6.3V  Package: 1210  [CAP_1210]  (hidden comment: CAP - 1210)
C4  value 1uF  Voltage: 10V  Package: 0603  [CAP_0603]  (hidden comment: CAP - 0603)
C5  value 47uF  Voltage: 6.3V  Package: 1210  [CAP_1210]  (hidden comment: CAP - 1210)
C6  value 330uF  Voltage: 6.3V  Package: 2917  [CAP_TAN_2917(D)]  (hidden comment: CAP - TANTALUM - CASE D)
C7  value 100uF  Voltage: 6.3V  Package: 1210  [CAP_1210]  (hidden comment: CAP - 1210)
C8  value 150uF  Voltage: 16V  Package: D8  Precision: 20%  [CAP_ALU_D8]  (hidden comment: EEE-FKC151XAP)
C9  value 100nF  Voltage: 50V  Package: 0402  [CAP_0402]  (hidden comment: CAP - 0402)
C10  value 1nF  Voltage: 50V  Package: 0402  [CAP_0402]  (hidden comment: CAP - 0402)
C11  value 10nF  Voltage: 50V  Package: 0402  [CAP_0402]  (hidden comment: CAP - 0402)
C12  value 330uF  Voltage: 16V  Package: 1010  Precision: 20%  [CAP_ALU_1010_vishay]  (hidden comment: MAL214699501E3)
C13  value 100uF  Voltage: 6.3V  Package: 1210  [CAP_1210]  (hidden comment: CAP - 1210)
C14  value 150uF  Voltage: 16V  Package: D8  Precision: 20%  [CAP_ALU_D8]  (hidden comment: EEE-FKC151XAP)
C15  value 4.7uF  Voltage: 50V  Package: 0805  [CAP_0805]  (hidden comment: CAP - 0805)
C16  value 100nF  Voltage: 50V  Package: 0402  [CAP_0402]  (hidden comment: CAP - 0402)
C17  value 10uF  Voltage: 10V  Package: 0805  [CAP_0805]  (hidden comment: CAP - 0805)
C18  value 10uF  Voltage: 10V  Package: 0805  [CAP_0805]  (hidden comment: CAP - 0805)
C19  value 10uF  Voltage: 10V  Package: 0805  [CAP_0805]  (hidden comment: CAP - 0805)
C20  value 1nF  Voltage: 50V  Package: 0402  [CAP_0402]  (hidden comment: CAP - 0402)
C21  value 10nF  Voltage: 50V  Package: 0402  [CAP_0402]  (hidden comment: CAP - 0402)
C22  value 10uF  Voltage: 10V  Package: 0805  [CAP_0805]  (hidden comment: CAP - 0805)
C23  value 10uF  Voltage: 10V  Package: 0805  [CAP_0805]  (hidden comment: CAP - 0805)
C24  value 1nF  Voltage: 50V  Package: 0402  [CAP_0402]  (hidden comment: CAP - 0402)
C25  value 100nF  Voltage: 16V  Package: 0402  [CAP_0402]  (hidden comment: CAP - 0402)
R1  value 100k  Package: 0402  Precision: 1%  [RES_0402]  (hidden comment: RES - 0402)
R2  value 100k  Package: 0402  Precision: 1%  [RES_0402]  (hidden comment: RES - 0402)
R3  value 12k1  Package: 0402  Precision: 1%  [RES_0402]  (hidden comment: RES - 0402)
R4  value 15k  Package: 0402  Precision: 1%  [RES_0402]  (hidden comment: RES - 0402)
R5  value 348k  Package: 0402  Precision: 1%  [RES_0402]  (hidden comment: RES - 0402)
R6  value 1k15  Package: 0402  Precision: 1%  [RES_0402]  (hidden comment: RES - 0402)
R7  value 6k98  Package: 0402  Precision: 1%  [RES_0402]  (hidden comment: RES - 0402)
R8  value 100k  Package: 0402  Precision: 1%  [RES_0402]  (hidden comment: RES - 0402)
R9  value 100k  Package: 0402  Precision: 1%  [RES_0402]  (hidden comment: RES - 0402)
R10  value 100k  Package: 0402  Precision: 1%  [RES_0402]  (hidden comment: RES - 0402)
R11  value 45K3  Package: 0402  Precision: 1%  [RES_0402]  (hidden comment: RES - 0402)
R12  value 10k  Package: 0402  Precision: 1%  [RES_0402]  (hidden comment: RES - 0402)
R13  value 10k  Package: 0402  Precision: 1%  [RES_0402]  (hidden comment: RES - 0402)
U1  LMZ30602RKGT  [REG_SWI_LMZ30606RKGT]
U2  PTH04T231WAZ  [REG_SWR_PTH04T231WAZ]
U3  TPS3808G01DBVR  [POW_TPS3808G01DBVR]
U4  PTH04T231WAZ  [REG_SWR_PTH04T231WAZ]
U5  TPS3808G01DBVR  [POW_TPS3808G01DBVR]
U6  TPS51200DRCT  [REG_PMIC_TPS51200DRCT]

### Blocks framed on the sheet
3V3D to 1V8: C2-C6 R5 R6 U1
3V3D to 1V2: C1 C7 C8 R3 U2
1V2 delay: C9-C11 R1 R2 R4 U3
3V3D to 1V5: C12-C14 R7 U4
DDR power delay: C16 C20 C21 R9-R11 U5
DDR power: C15 C17-C19 C22-C25 R8 R12 R13 U6

### Nets
1V2: C7.2 C8.1 U2.4(VO) U2.5(Sense+)
1V5: C13.2 C14.1 C22.2 C23.2 R10.2 R12.2 U4.4(VO) U4.5(Sense+) U6.2(VLDOIN)
1V8: C5.2 C6.1 U1.8(VOUT) U1.9(VOUT) U1.10(VOUT) U1.11(VOUT) U1.12(VOUT) U1.13(VOUT) U1.14(VOUT) U1.36(SENSE+) U1.38(VOUT)
3V3D: C1.1 C2.1 C3.2 C4.2 C9.2 C12.1 C15.2 C16.2 R1.2 R2.2 R8.2 R9.2 U1.30(VIN) U1.31(VIN) U1.32(VIN) U2.2(VI) U2.9(Track) U3.6(VDD) U4.2(VI) U4.9(Track) U5.6(VDD) U6.10(VIN)
GND: C1.2 C2.2 C3.1 C4.1 C5.1 C6.2 C7.1 C8.2 C9.1 C10.1 C11.1 C12.2 C13.1 C14.2 C15.1 C16.1 C17.1 C18.1 C19.1 C20.1 C21.1 C22.1 C23.1 C24.1 C25.1 R3.1 R4.1 R5.1 R6.1 R7.1 R11.1 R13.1 U1.1(AGND) U1.5(AGND) U1.7(STSEL) U1.29(AGND) U1.33(AGND) U1.34(AGND) U1.37(PGND) U2.1(SmartSync) U2.3(GND) U2.6(Sense-) U3.2(GND) U4.1(SmartSync) U4.3(GND) U4.6(Sense-) U5.2(GND) U6.4(PGND) U6.8(GND) U6.11(EP)
VTT: C17.2 C18.2 C19.2 U6.3(VO) U6.5(VOSNS)
VTT_REF: C25.2 U6.6(REFOUT)
DDR_PWR_EN: R9.1 U5.1(~{RESET}) U6.7(EN)
ENA_1V2: R1.1 U2.10(Inhibit/UVLO) U3.1(~{RESET})
PGOOD_DDR: R8.1 U6.9(PGOOD)
NetC10_2: C10.2 R2.1 R4.2 U3.5(SENSE)
NetC11_2: C11.2 U3.4(CT)
NetC20_2: C20.2 R10.1 R11.2 U5.5(SENSE)
NetC21_2: C21.2 U5.4(CT)
NetC24_2: C24.2 R12.1 R13.2 U6.1(REFIN)
NetR3_2: R3.2 U2.7(VO_Adj)
NetR5_2: R5.2 U1.4(RT/CLK)
NetR6_2: R6.2 U1.35(VADJ)
NetR7_2: R7.2 U4.7(VO_Adj)
NetU1_17: U1.17(PH) U1.18(PH) U1.19(PH) U1.20(PH) U1.21(PH) U1.22(PH) U1.23(PH) U1.24(PH) U1.25(PH) U1.39(PH)

Not connected (* = marked no-connect by the designer): U1 2(DNC)* 3(DNC)* 6(SS/TR)* 15(DNC)* 16(DNC)* 26(DNC)* 27(PWRGD)* 28(INH/UVLO)*; U2 8(TurboTrans)*; U3 3(~{MR})*; U4 8(TurboTrans)* 10(Inhibit/UVLO)*; U5 3(~{MR})*

### Notes on the sheet
- (near U1) Small Copper island for thermal relief (PH pins)check layout considerations
- Inhibit : applying low-level = disable module. If left unconnected, Vout will be made when Vin is ok.
  Turbotrans changes the transient response
  SmartSync synchronise the switching frequency to an external clock.. GND if unused
- 1.18A@3V3D
- Input consumption
- 3A@1V2D
- Output consumption
- Efficiency = 92%
- Power consumption
- Delay = 60ms
  VTH = 3.05 - 3.15 V
- 40uA @ 3V3D
- 10uA @ 1V5
- 388mA@3v3D
- Efficiency = 94%
- 666mA@1V8
- 1.08A@3V3D
- 2.07A@1V5D
- If used PG pin should be connected to pullup resistor (10k to 1M) to a supply up to 5V5.
- See fig.24 of datasheet (p. 18) for reference
- Design Note:
  VIN bypass cap value between 1uF and 4.7uF
- Only constraint of power-on sequence :
  VTT (0.75V) must come after 1V5 -> 1V5 is used to make VTT
  The FPGA core (1V2) must come after the flash (3V3D) -> 3V3D is used to make 1V2D
  Futhermore, the PTH04T230W has a soft start feature.
- Delay = 60ms
  VTH = 1.28-1.32 V
- 10mA @ 3V3
- 500mA @ 1V5
- Efficiency = 50%
- 500mA @ VTT (0V75)
- 10mA @ VTT_REF (0V75)
- Sheet Name
- Project Title
- Global Project
- Size
- Group
- Revision
- Date
- Sheet
- of
- Filename
- Designers
- (in symbol POW_TPS3808G01DBVR) Reset; Logic; Timer; .4V ref
- (in symbol REG_SWR_LMZ30602RKGT) SWR
- (in symbol REG_SWR_PTH04T231WAZ) SWR

### Library data of the parts
C1 C12 = CAP_ALU_MAL214699501E3: as C259 on sheet S7CAS-PLEIADES-CARTE-MERE_P07_HIGH_POWER; Mfg Part Number: MAL214699501E3; HelpURL: http://www.vishay.com/docs/28403/146cti.pdf; CreatedBy: Jonathan Bouchard; Temperature: -55°C to 125°C; Power: *; Supplier 1: Digikey; Supplier Part Number 1: 4405PHCT-ND
C2 C6 = CAP_TANT_2917(D): CAP - TANTALUM - 2917; Precision: 10%; Current: *; CreatedBy: Jonathan Bouchard; Power: *
C3 C5 C7 C13 = CAP - 1210: Precision: 10%; Current: *; CreatedBy: Jonathan Bouchard; Power: *
C4 = CAP - 0603: Precision: 10%; Current: *; CreatedBy: Jonathan Bouchard; Power: *
C8 C14 = CAP_ALU_EEH-ZS1H151P: as C261 on sheet S7CAS-PLEIADES-CARTE-MERE_P07_HIGH_POWER; CreatedBy: Philippe; Temperature: -55°C ~ 105°C; Power: *; Supplier 1: Digi-Key; Supplier Part Number 1: PCE4401CT-ND
C9 C10 C16 C20 C24 = CAP - 0402: Mfg: C1005X7R1H102K050BA; Precision: 10%; Current: *; CreatedBy: Jonathan Bouchard; Power: *
C11 C21 = CAP - 0402: Precision: 10%; Current: *; CreatedBy: Jonathan Bouchard; Power: *
C15 = CAP - 0805: Precision: 10%; Current: *; CreatedBy: Jonathan Bouchard; Power: *
C17-C19 C22 C23 = CAP - 0805: Mfg: CL21B106KPQNNNE; Precision: 10%; Current: *; CreatedBy: Jonathan Bouchard; Power: *
C25 = CAP - 0402: Mfg Part Number: CL05B104KO5NNNC; Precision: 10%; Current: *; CreatedBy: Jonathan Bouchard; Power: *
R1-R13 = RES - 0402: Voltage: 50V; Power: 1/16W; Current: *; CreatedBy: Jonathan Bouchard
U1 = REG_SWR_LMZ30602RKGT: REG - DC DC Converter / Non-Isolated  Output 0.8 ~ 3.6V 2A 2.95V - 6V Input; Manufacturer #1: Texas Instruments; Value: 0.8-3.6V; Voltage Rating: 2.95-6V; Power Max: 7W; GRAMS Lib Spec: 2.8c; Magnetic Material: Unknown; Polarized: Yes; Tolerance: *; Current Rating: 2A; HelpURL: https://www.ti.com/lit/ds/symlink/lmz30602.pdf?ts=1612193535337&ref_url=https%253A%252F%252Fwww.ti.com%252Fproduct%252FLMZ30602%253Futm_source%253Dgoogle%2526utm_medium%253Dcpc%2526utm_campaign%253Dapp-null-null-GPN_EN-cpc-pf-google-wwe%2526utm_content%253DLMZ30602%2526ds_k%253DLMZ30602%2526DCM%253Dyes%2526gclid%253DCj0KCQiA6t6ABhDMARIsAONIYywbX5HTDjPcy63-ILCw60ouTSqFGPALMyLaft3c1Oc_UEXWX4eCDSkaAiF9EALw_wcB%2526gclsrc%253Daw.ds; CreatedBy/Date: Philippe Arsenault/2021-02-01; Temperature: -40°C ~ 85°C; Package: 39-BQFN Module; Manufacturer #2: *; Note: *; Assembly Type: SMD; Part Number #2: *; Part Number #1: LMZ30602RKGT; Cryo: UNKNOWN; Supplier 1: Digi-Key; Supplier Part Number 1: 296-37029-1-ND
U2 U4 = REG_SWR_PTH04T231WAZ: as U25 on sheet S7CAS-PLEIADES-CARTE-MERE_P07_HIGH_POWER; Manufacturer #2: *; Note: *; Power Max: *; Part Number #1: PTH04T231WAZ; Part Number #2: *; HelpURL: http://www.ti.com/lit/ds/symlink/pth04t231w.pdf; Supplier 1: Digi-Key; Assembly Type: SMD; Temperature: -40°C ~ 85°C; Supplier Part Number 1: 296-21792-ND; Package: SMD; CreatedBy/Date: Olivier Bernard / 6/5/2018; VerifiedBy: Caroline Paulin / 10 juillet 2018; Cryo: UNKNOWN
U3 U5 = POW_TPS3808G01DBVR: POW - Programmable-Delay  Voltage Supervisory adj - SOT-23-6; Manufacturer #1: Texas Instruments; GRAMS Lib Spec: 2.8; Magnetic Material: Unknown; Polarized: Yes; Value: *; Tolerance: *; Voltage Rating: *; Current Rating: *; Power Max: *; HelpURL: http://www.ti.com/lit/ds/symlink/tps3808.pdf; CreatedBy/Date: Joel Lemay 2018-11-13; VerifiedBy: Caroline Paulin - 22/11/2018; Temperature: -40°C ~ 125°C; Package: SOT-23-6; Manufacturer #2: *; Assembly Type: SMD; Part Number #2: *; Part Number #1: TPS3808G01DBVR; Supplier 1: Digi-Key; Supplier Part Number 1: 296-17188-1-ND; Cryo: UNKNOWN
U6 = REG_PMIC_TPS51200DRCT: REG - DDR TERMINATION/REF REG - 10-VFDFN; Manufacturer #1: Texas Instruments; Value: DDR, DDR2, DDR3(L), DDR4; Voltage Rating: 2.375V ~ 3.5V; Current Rating: Source: 3A~4.5A, Sink: 3.5A~5.5A; GRAMS Lib Spec: 2.8; Magnetic Material: Unknown; Polarized: Yes; Tolerance: *; Power Max: *; HelpURL: http://www.ti.com/lit/ds/symlink/tps51200.pdf; CreatedBy/Date: Joel Lemay 2019-03-19; VerifiedBy: Nicolas V. (2019-05-31); Temperature: -40°C ~ 85°C; Package: 10-VFDFN; Manufacturer #2: *; Note: *; Assembly Type: SMD; Part Number #2: *; Part Number #1: TPS51200DRCT; Supplier 1: Digi-Key; Supplier Part Number 1: 296-23830-1-ND; Cryo: UNKNOWN

## Sheet S7CAS-PLEIADES-CARTE-MERE_P07_FPGA_0.SchDoc
size Tabloid; DocumentNumber: 4; SheetNumber: 4; SheetTotal: 16; Sheet_Name: FPGA_0; Size: 11x17
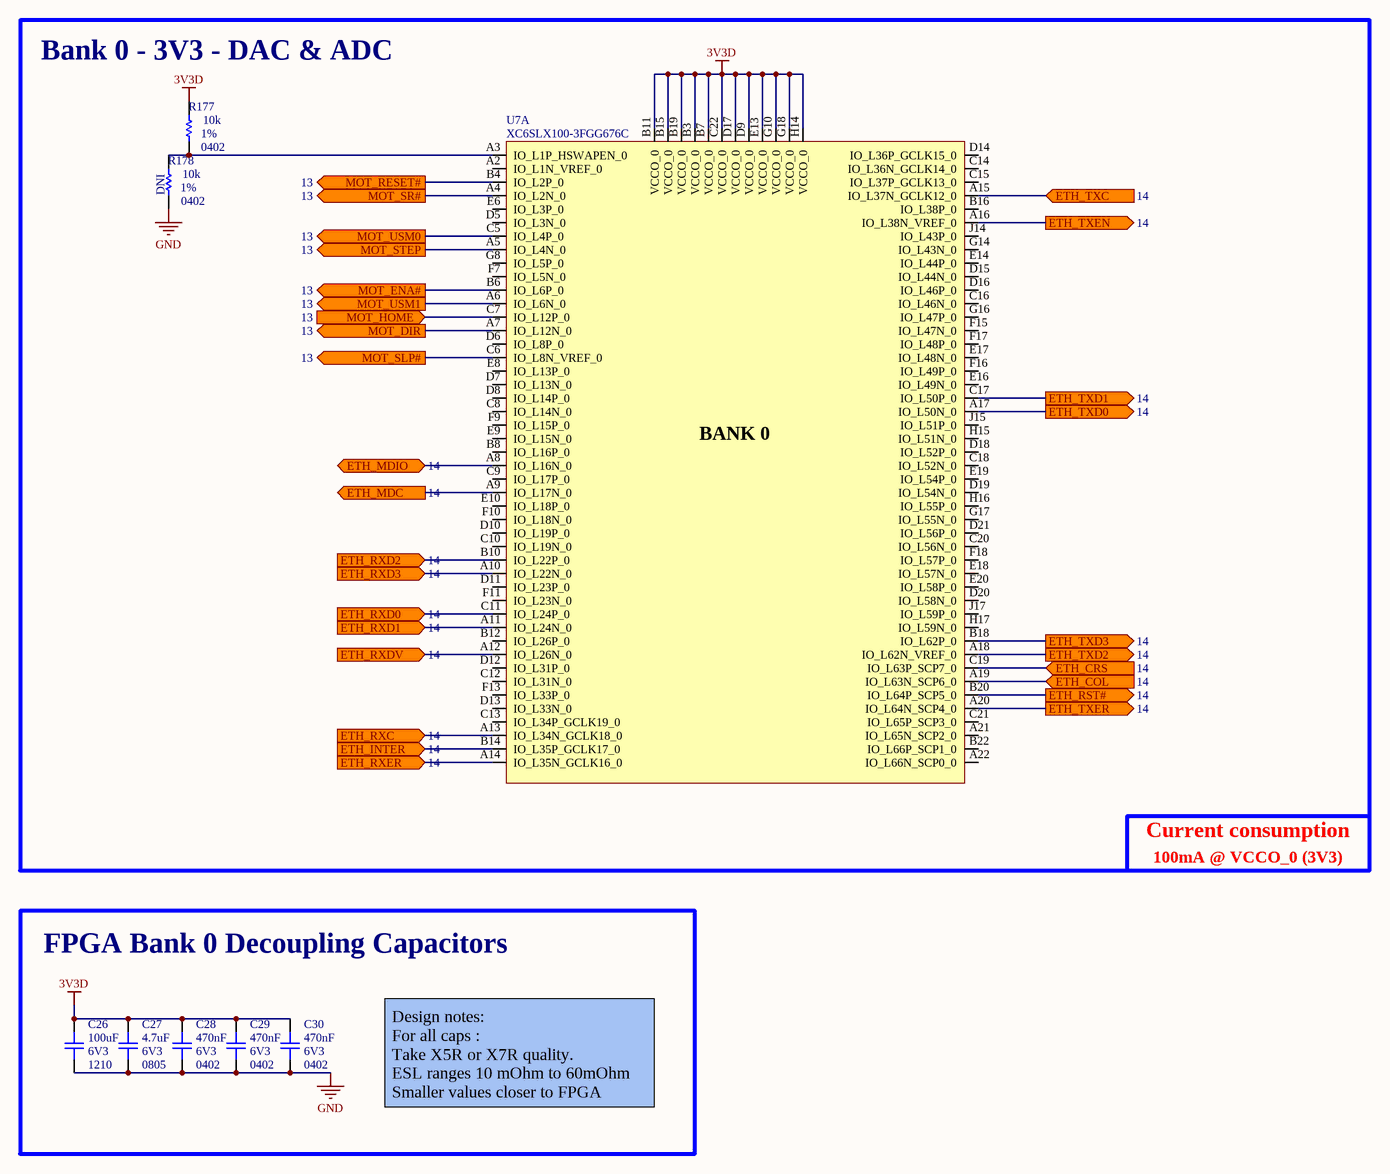
[diagram p3: S7CAS-PLEIADES-CARTE-MERE_P07_FPGA_0.SchDoc]

### Parts
C26  value 100uF  Voltage: 6V3  Package: 1210  [CAP_1210]  (hidden comment: CAP - 1210)
C27  value 4.7uF  Voltage: 6V3  Package: 0805  [CAP_0805]  (hidden comment: CAP - 0805)
C28  value 470nF  Voltage: 6V3  Package: 0402  [CAP_0402]  (hidden comment: CAP - 0402)
C29  value 470nF  Voltage: 6V3  Package: 0402  [CAP_0402]  (hidden comment: CAP - 0402)
C30  value 470nF  Voltage: 6V3  Package: 0402  [CAP_0402]  (hidden comment: CAP - 0402)
R177  value 10k  Package: 0402  Precision: 1%  [RES_0402]  (hidden comment: RES - 0402)
R178  value 10k  NI: DNI  Package: 0402  Precision: 1%  [RES_0402]  (hidden comment: RES - 0402)
U7  XC6SLX100-3FGG676C  [FPGA_XILINX_FGG676]  (part A of 10)

### Blocks framed on the sheet
Bank 0 - 3V3 - DAC & ADC: R177 R178 U7
FPGA Bank 0 Decoupling Capacitors: C26-C30

### Ports
ETH_COL (in, see 14), ETH_CRS (in, see 14), ETH_INTER (in, see 14), ETH_MDC (out, see 14), ETH_MDIO (bidir, see 14), ETH_RST# (out, see 14), ETH_RXC (in, see 14), ETH_RXD0 (in, see 14), ETH_RXD1 (in, see 14), ETH_RXD2 (in, see 14), ETH_RXD3 (in, see 14), ETH_RXDV (in, see 14), ETH_RXER (in, see 14), ETH_TXC (in, see 14), ETH_TXD0 (out, see 14), ETH_TXD1 (out, see 14), ETH_TXD2 (out, see 14), ETH_TXD3 (out, see 14), ETH_TXEN (out, see 14), ETH_TXER (out, see 14), MOT_DIR (out, see 13), MOT_ENA# (out, see 13), MOT_HOME (in, see 13), MOT_RESET# (out, see 13), MOT_SLP# (out, see 13), MOT_SR# (out, see 13), MOT_STEP (out, see 13), MOT_USM0 (out, see 13), MOT_USM1 (out, see 13)

### Nets
3V3D: C26.2 C27.2 C28.2 C29.2 C30.2 R177.2 U7.B3(VCCO_0) U7.B7(VCCO_0) U7.B11(VCCO_0) U7.B15(VCCO_0) U7.B19(VCCO_0) U7.C22(VCCO_0) U7.D9(VCCO_0) U7.D17(VCCO_0) U7.E13(VCCO_0) U7.G10(VCCO_0) U7.G18(VCCO_0) U7.H14(VCCO_0)
GND: C26.1 C27.1 C28.1 C29.1 C30.1 R178.1
ETH_COL: U7.A19(IO_L63N_SCP6_0) ; port ETH_COL
ETH_CRS: U7.C19(IO_L63P_SCP7_0) ; port ETH_CRS
ETH_INTER: U7.B14(IO_L35P_GCLK17_0) ; port ETH_INTER
ETH_MDC: U7.A9(IO_L17N_0) ; port ETH_MDC
ETH_MDIO: U7.A8(IO_L16N_0) ; port ETH_MDIO
ETH_RST#: U7.B20(IO_L64P_SCP5_0) ; port ETH_RST#
ETH_RXC: U7.A13(IO_L34N_GCLK18_0) ; port ETH_RXC
ETH_RXD0: U7.C11(IO_L24P_0) ; port ETH_RXD0
ETH_RXD1: U7.A11(IO_L24N_0) ; port ETH_RXD1
ETH_RXD2: U7.B10(IO_L22P_0) ; port ETH_RXD2
ETH_RXD3: U7.A10(IO_L22N_0) ; port ETH_RXD3
ETH_RXDV: U7.A12(IO_L26N_0) ; port ETH_RXDV
ETH_RXER: U7.A14(IO_L35N_GCLK16_0) ; port ETH_RXER
ETH_TXC: U7.A15(IO_L37N_GCLK12_0) ; port ETH_TXC
ETH_TXD0: U7.A17(IO_L50N_0) ; port ETH_TXD0
ETH_TXD1: U7.C17(IO_L50P_0) ; port ETH_TXD1
ETH_TXD2: U7.A18(IO_L62N_VREF_0) ; port ETH_TXD2
ETH_TXD3: U7.B18(IO_L62P_0) ; port ETH_TXD3
ETH_TXEN: U7.A16(IO_L38N_VREF_0) ; port ETH_TXEN
ETH_TXER: U7.A20(IO_L64N_SCP4_0) ; port ETH_TXER
MOT_DIR: U7.A7(IO_L12N_0) ; port MOT_DIR
MOT_ENA#: U7.B6(IO_L6P_0) ; port MOT_ENA#
MOT_HOME: U7.C7(IO_L12P_0) ; port MOT_HOME
MOT_RESET#: U7.B4(IO_L2P_0) ; port MOT_RESET#
MOT_SLP#: U7.C6(IO_L8N_VREF_0) ; port MOT_SLP#
MOT_SR#: U7.A4(IO_L2N_0) ; port MOT_SR#
MOT_STEP: U7.A5(IO_L4N_0) ; port MOT_STEP
MOT_USM0: U7.C5(IO_L4P_0) ; port MOT_USM0
MOT_USM1: U7.A6(IO_L6N_0) ; port MOT_USM1
NetR177_1: R177.1 R178.2 U7.A3(IO_L1P_HSWAPEN_0)

Not connected (* = marked no-connect by the designer): U7 A2(IO_L1N_VREF_0) A21(IO_L65N_SCP2_0) A22(IO_L66N_SCP0_0) B8(IO_L16P_0) B12(IO_L26P_0) B16(IO_L38P_0) B22(IO_L66P_SCP1_0) C8(IO_L14N_0) C9(IO_L17P_0) C10(IO_L19N_0) C12(IO_L31N_0) C13(IO_L34P_GCLK19_0) C14(IO_L36N_GCLK14_0) C15(IO_L37P_GCLK13_0) C16(IO_L46N_0) C18(IO_L52N_0) C20(IO_L56N_0) C21(IO_L65P_SCP3_0) D5(IO_L3N_0) D6(IO_L8P_0) D7(IO_L13N_0) D8(IO_L14P_0) D10(IO_L19P_0) D11(IO_L23P_0) D12(IO_L31P_0) D13(IO_L33N_0) D14(IO_L36P_GCLK15_0) D15(IO_L44N_0) D16(IO_L46P_0) D18(IO_L52P_0) D19(IO_L54N_0) D20(IO_L58N_0) D21(IO_L56P_0) E6(IO_L3P_0) E8(IO_L13P_0) E9(IO_L15N_0) E10(IO_L18P_0) E14(IO_L44P_0) E16(IO_L49N_0) E17(IO_L48N_0) E18(IO_L57N_0) E19(IO_L54P_0) E20(IO_L58P_0) F7(IO_L5N_0) F9(IO_L15P_0) F10(IO_L18N_0) F11(IO_L23N_0) F13(IO_L33P_0) F15(IO_L47N_0) F16(IO_L49P_0) F17(IO_L48P_0) F18(IO_L57P_0) G8(IO_L5P_0) G14(IO_L43N_0) G16(IO_L47P_0) G17(IO_L55N_0) H15(IO_L51N_0) H16(IO_L55P_0) H17(IO_L59N_0) J14(IO_L43P_0) J15(IO_L51P_0) J17(IO_L59P_0)

### Notes on the sheet
- 100mA @ VCCO_0 (3V3)
- Current consumption
- Design notes:
  For all caps :
  Take X5R or X7R quality.
  ESL ranges 10 mOhm to 60mOhm
  Smaller values closer to FPGA
- Sheet Name
- Project Title
- Global Project
- Size
- Group
- Revision
- Date
- Sheet
- of
- Filename
- Designers
- (in symbol FPGA_XC6SLX100-3FGG676C, part A) BANK 0

### Library data of the parts
C26 = CAP - 1210: Precision: 10%; Current: *; CreatedBy: Jonathan Bouchard; Power: *
C27 = CAP - 0805: Precision: 10%; Current: *; CreatedBy: Jonathan Bouchard; Power: *
C28-C30 = CAP - 0402: Precision: 10%; Current: *; CreatedBy: Jonathan Bouchard; Power: *
R177 R178 = RES - 0402: Voltage: 50V; Power: 1/16W; Current: *; CreatedBy: Jonathan Bouchard
  R177: Parameter 1: *
U7 = FPGA_XC6SLX100-3FGG676C: FPGA - XILINX SPARTAN 6 480 I/O - BGA-676; Voltage: 1.14 V ~ 1.26 V; Current: *; Power: *; Mfg: Xilinx; Mfg Part Number: XC6SLX100-3FGG676C; HelpURL: https://www.xilinx.com/support/documentation/data_sheets/ds162.pdf; CreatedBy: Jonathan Bouchard; Temperature: 0°C ~ 85°C (TJ); Value: *; Precision: *; Package: BGA-676; Supplier 1: Digikey; Supplier Part Number 1: 122-1760-ND

## Sheet S7CAS-PLEIADES-CARTE-MERE_P07_FPGA_1.SchDoc
size Tabloid; DocumentNumber: 5; SheetNumber: 5; SheetTotal: 16; Sheet_Name: FPGA_1; Size: 11x17
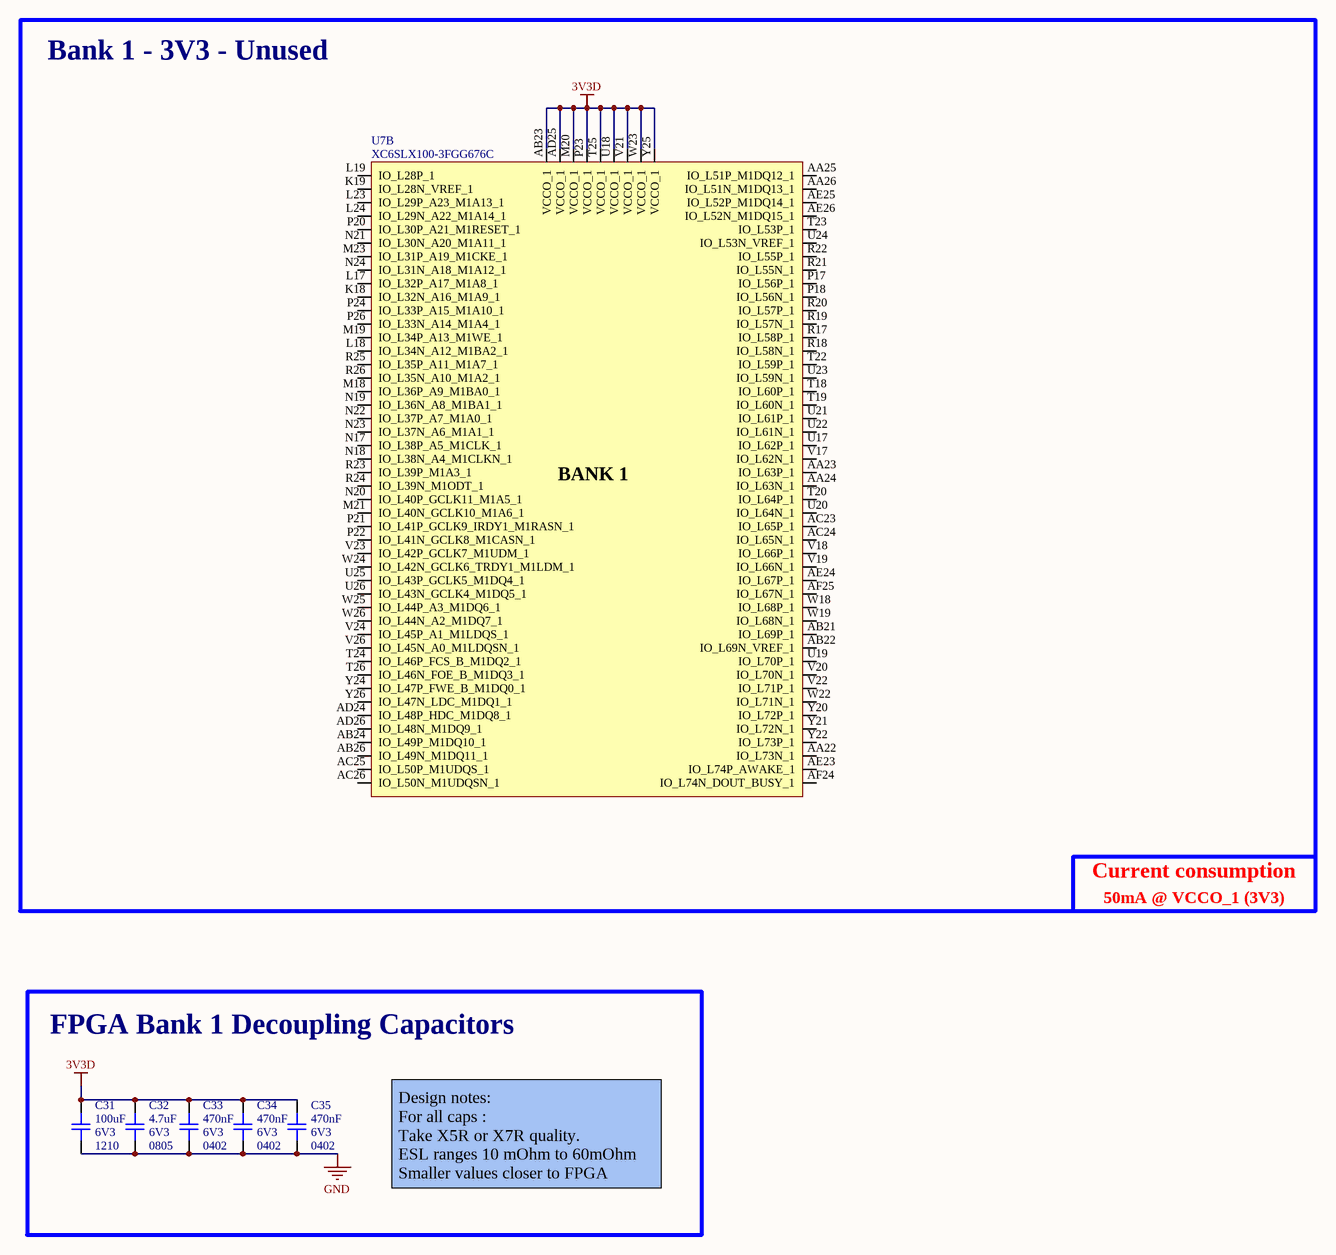
[diagram p4: S7CAS-PLEIADES-CARTE-MERE_P07_FPGA_1.SchDoc]

### Parts
C31  value 100uF  Voltage: 6V3  Package: 1210  [CAP_1210]  (hidden comment: CAP - 1210)
C32  value 4.7uF  Voltage: 6V3  Package: 0805  [CAP_0805]  (hidden comment: CAP - 0805)
C33  value 470nF  Voltage: 6V3  Package: 0402  [CAP_0402]  (hidden comment: CAP - 0402)
C34  value 470nF  Voltage: 6V3  Package: 0402  [CAP_0402]  (hidden comment: CAP - 0402)
C35  value 470nF  Voltage: 6V3  Package: 0402  [CAP_0402]  (hidden comment: CAP - 0402)
U7  XC6SLX100-3FGG676C  [FPGA_XILINX_FGG676]  (part B of 10)

### Blocks framed on the sheet
Bank 1 - 3V3 - Unused: U7
FPGA Bank 1 Decoupling Capacitors: C31-C35

### Nets
3V3D: C31.2 C32.2 C33.2 C34.2 C35.2 U7.AB23(VCCO_1) U7.AD25(VCCO_1) U7.M20(VCCO_1) U7.P23(VCCO_1) U7.T25(VCCO_1) U7.U18(VCCO_1) U7.V21(VCCO_1) U7.W23(VCCO_1) U7.Y25(VCCO_1)
GND: C31.1 C32.1 C33.1 C34.1 C35.1

Not connected (* = marked no-connect by the designer): U7 AA22(IO_L73N_1) AA23(IO_L63P_1) AA24(IO_L63N_1) AA25(IO_L51P_M1DQ12_1) AA26(IO_L51N_M1DQ13_1) AB21(IO_L69P_1) AB22(IO_L69N_VREF_1) AB24(IO_L49P_M1DQ10_1) AB26(IO_L49N_M1DQ11_1) AC23(IO_L65P_1) AC24(IO_L65N_1) AC25(IO_L50P_M1UDQS_1) AC26(IO_L50N_M1UDQSN_1) AD24(IO_L48P_HDC_M1DQ8_1) AD26(IO_L48N_M1DQ9_1) AE23(IO_L74P_AWAKE_1) AE24(IO_L67P_1) AE25(IO_L52P_M1DQ14_1) AE26(IO_L52N_M1DQ15_1) AF24(IO_L74N_DOUT_BUSY_1) AF25(IO_L67N_1) K18(IO_L32N_A16_M1A9_1) K19(IO_L28N_VREF_1) L17(IO_L32P_A17_M1A8_1) L18(IO_L34N_A12_M1BA2_1) L19(IO_L28P_1) L23(IO_L29P_A23_M1A13_1) L24(IO_L29N_A22_M1A14_1) M18(IO_L36P_A9_M1BA0_1) M19(IO_L34P_A13_M1WE_1) M21(IO_L40N_GCLK10_M1A6_1) M23(IO_L31P_A19_M1CKE_1) N17(IO_L38P_A5_M1CLK_1) N18(IO_L38N_A4_M1CLKN_1) N19(IO_L36N_A8_M1BA1_1) N20(IO_L40P_GCLK11_M1A5_1) N21(IO_L30N_A20_M1A11_1) N22(IO_L37P_A7_M1A0_1) N23(IO_L37N_A6_M1A1_1) N24(IO_L31N_A18_M1A12_1) P17(IO_L56P_1) P18(IO_L56N_1) P20(IO_L30P_A21_M1RESET_1) P21(IO_L41P_GCLK9_IRDY1_M1RASN_1) P22(IO_L41N_GCLK8_M1CASN_1) P24(IO_L33P_A15_M1A10_1) P26(IO_L33N_A14_M1A4_1) R17(IO_L58P_1) R18(IO_L58N_1) R19(IO_L57N_1) R20(IO_L57P_1) R21(IO_L55N_1) R22(IO_L55P_1) R23(IO_L39P_M1A3_1) R24(IO_L39N_M1ODT_1) R25(IO_L35P_A11_M1A7_1) R26(IO_L35N_A10_M1A2_1) T18(IO_L60P_1) T19(IO_L60N_1) T20(IO_L64P_1) T22(IO_L59P_1) T23(IO_L53P_1) T24(IO_L46P_FCS_B_M1DQ2_1) T26(IO_L46N_FOE_B_M1DQ3_1) U17(IO_L62P_1) U19(IO_L70P_1) U20(IO_L64N_1) U21(IO_L61P_1) U22(IO_L61N_1) U23(IO_L59N_1) U24(IO_L53N_VREF_1) U25(IO_L43P_GCLK5_M1DQ4_1) U26(IO_L43N_GCLK4_M1DQ5_1) V17(IO_L62N_1) V18(IO_L66P_1) V19(IO_L66N_1) V20(IO_L70N_1) V22(IO_L71P_1) V23(IO_L42P_GCLK7_M1UDM_1) V24(IO_L45P_A1_M1LDQS_1) V26(IO_L45N_A0_M1LDQSN_1) W18(IO_L68P_1) W19(IO_L68N_1) W22(IO_L71N_1) W24(IO_L42N_GCLK6_TRDY1_M1LDM_1) W25(IO_L44P_A3_M1DQ6_1) W26(IO_L44N_A2_M1DQ7_1) Y20(IO_L72P_1) Y21(IO_L72N_1) Y22(IO_L73P_1) Y24(IO_L47P_FWE_B_M1DQ0_1) Y26(IO_L47N_LDC_M1DQ1_1)

### Notes on the sheet
- Current consumption
- 50mA @ VCCO_1 (3V3)
- Design notes:
  For all caps :
  Take X5R or X7R quality.
  ESL ranges 10 mOhm to 60mOhm
  Smaller values closer to FPGA
- Sheet Name
- Project Title
- Global Project
- Size
- Group
- Revision
- Date
- Sheet
- of
- Filename
- Designers
- (in symbol FPGA_XC6SLX100-3FGG676C, part B) BANK 1

### Library data of the parts
C31 = CAP - 1210: Precision: 10%; Current: *; CreatedBy: Jonathan Bouchard; Power: *
C32 = CAP - 0805: Precision: 10%; Current: *; CreatedBy: Jonathan Bouchard; Power: *
C33-C35 = CAP - 0402: Precision: 10%; Current: *; CreatedBy: Jonathan Bouchard; Power: *
U7 = FPGA_XC6SLX100-3FGG676C: as U7 on sheet S7CAS-PLEIADES-CARTE-MERE_P07_FPGA_0; Current: *; Power: *; Mfg: Xilinx; Mfg Part Number: XC6SLX100-3FGG676C; HelpURL: https://www.xilinx.com/support/documentation/data_sheets/ds162.pdf; CreatedBy: Jonathan Bouchard; Temperature: 0°C ~ 85°C (TJ); Value: *; Precision: *; Package: BGA-676; Supplier 1: Digikey; Supplier Part Number 1: 122-1760-ND